# EAGLE schematic fmc-host (EAGLE 8.3.2)
DESIGNER: JON NEWMAN; DESIGN_NAME: ONIX FMC HOST; LICENSE: SEE LICENSE FILE; REVISION: F
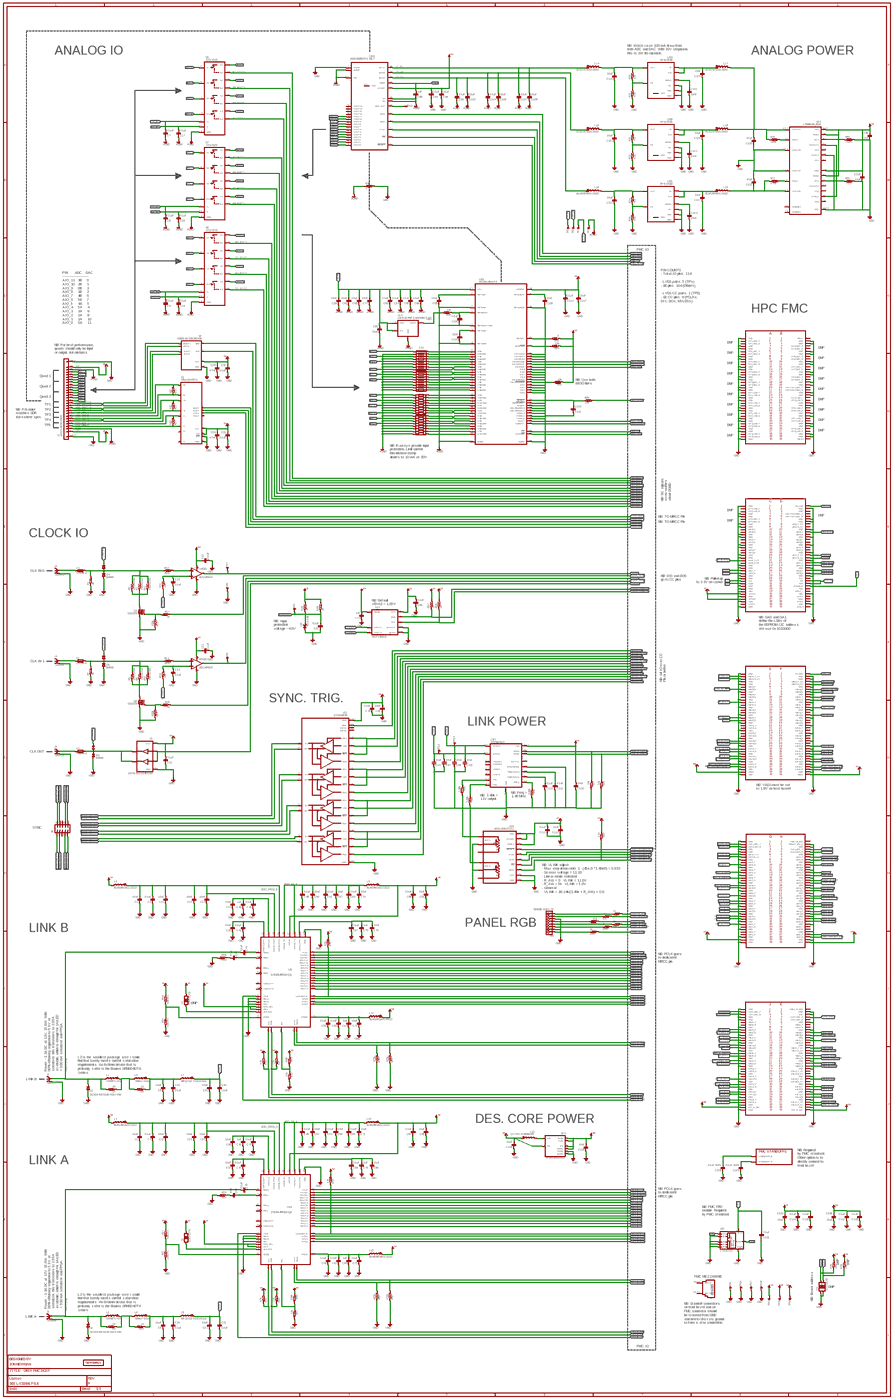
[diagram p0: schematic, sheet 1, overview]
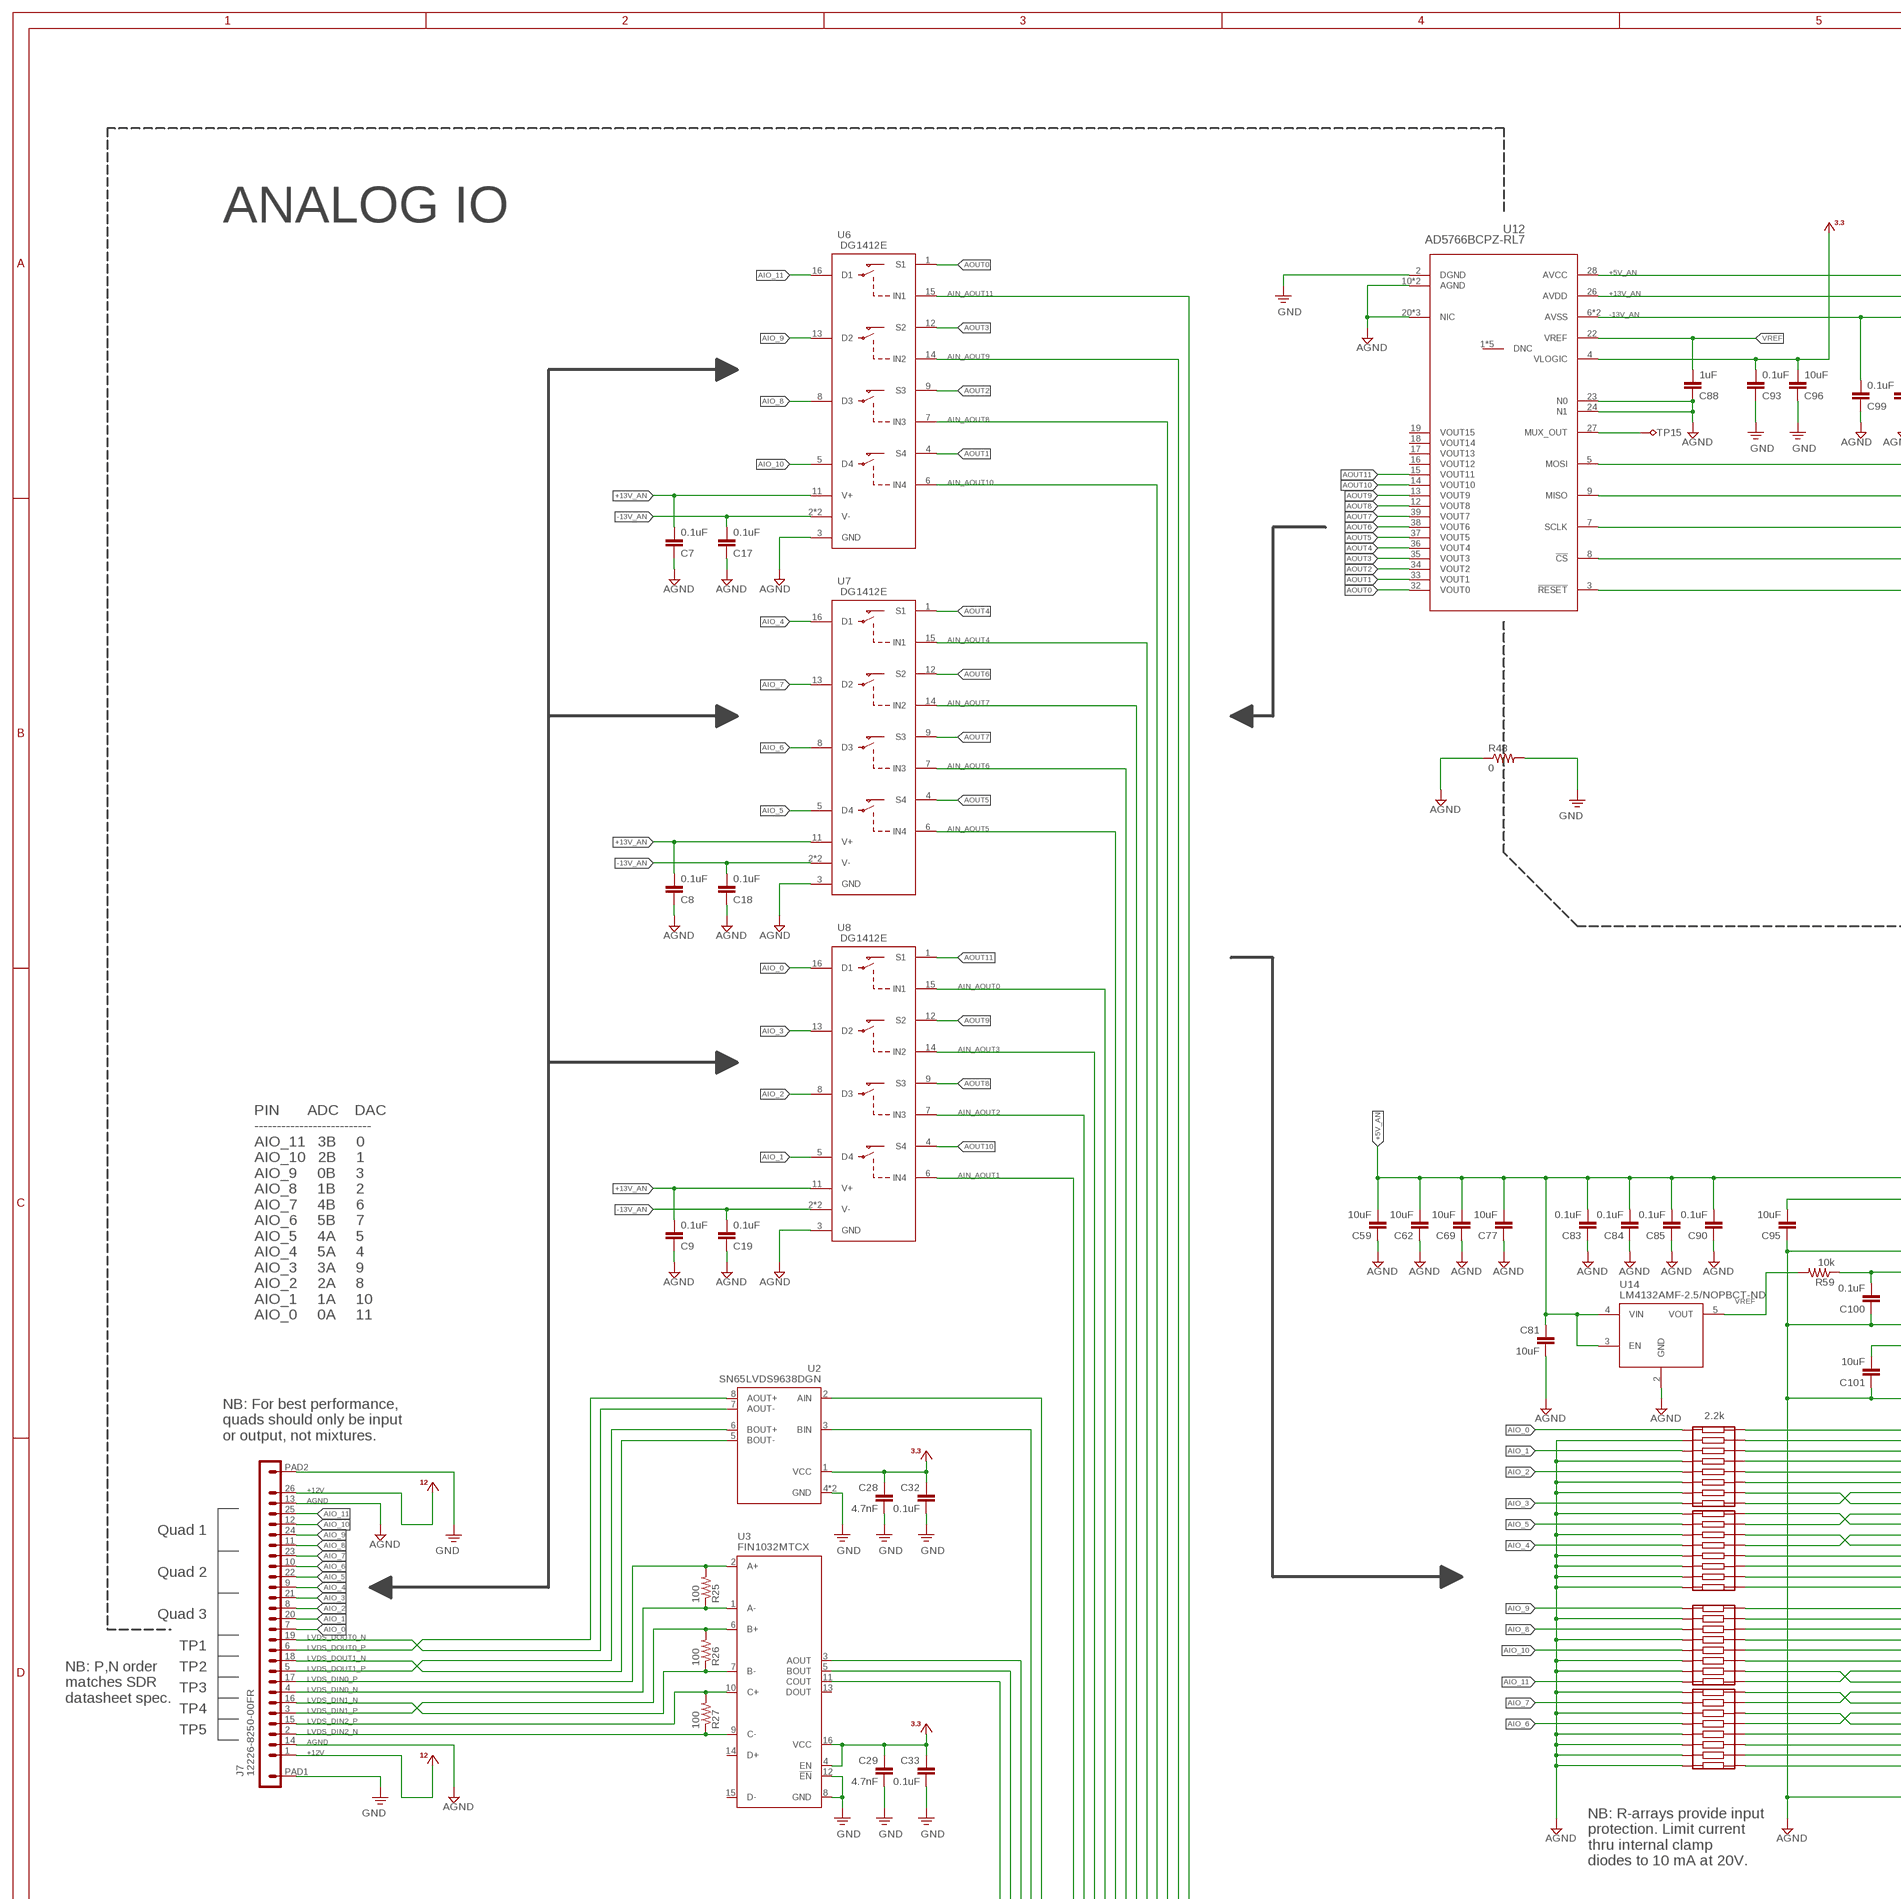
[diagram p1: schematic, sheet 1, part 1 of 8]
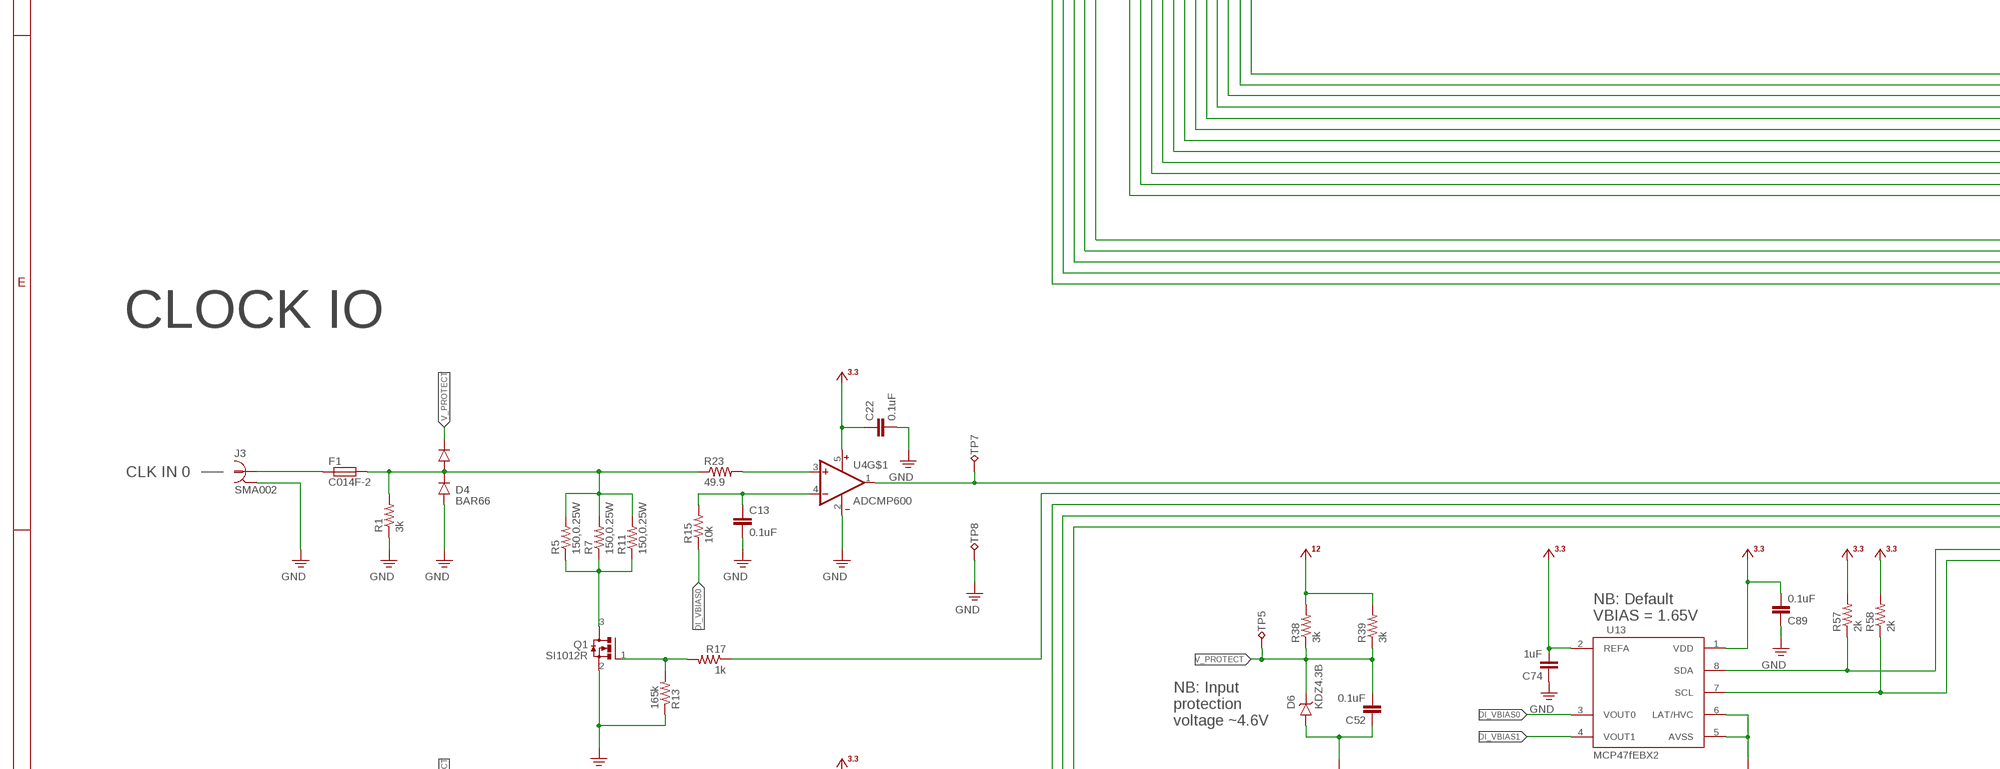
[diagram p2: schematic, sheet 1, part 2 of 8]
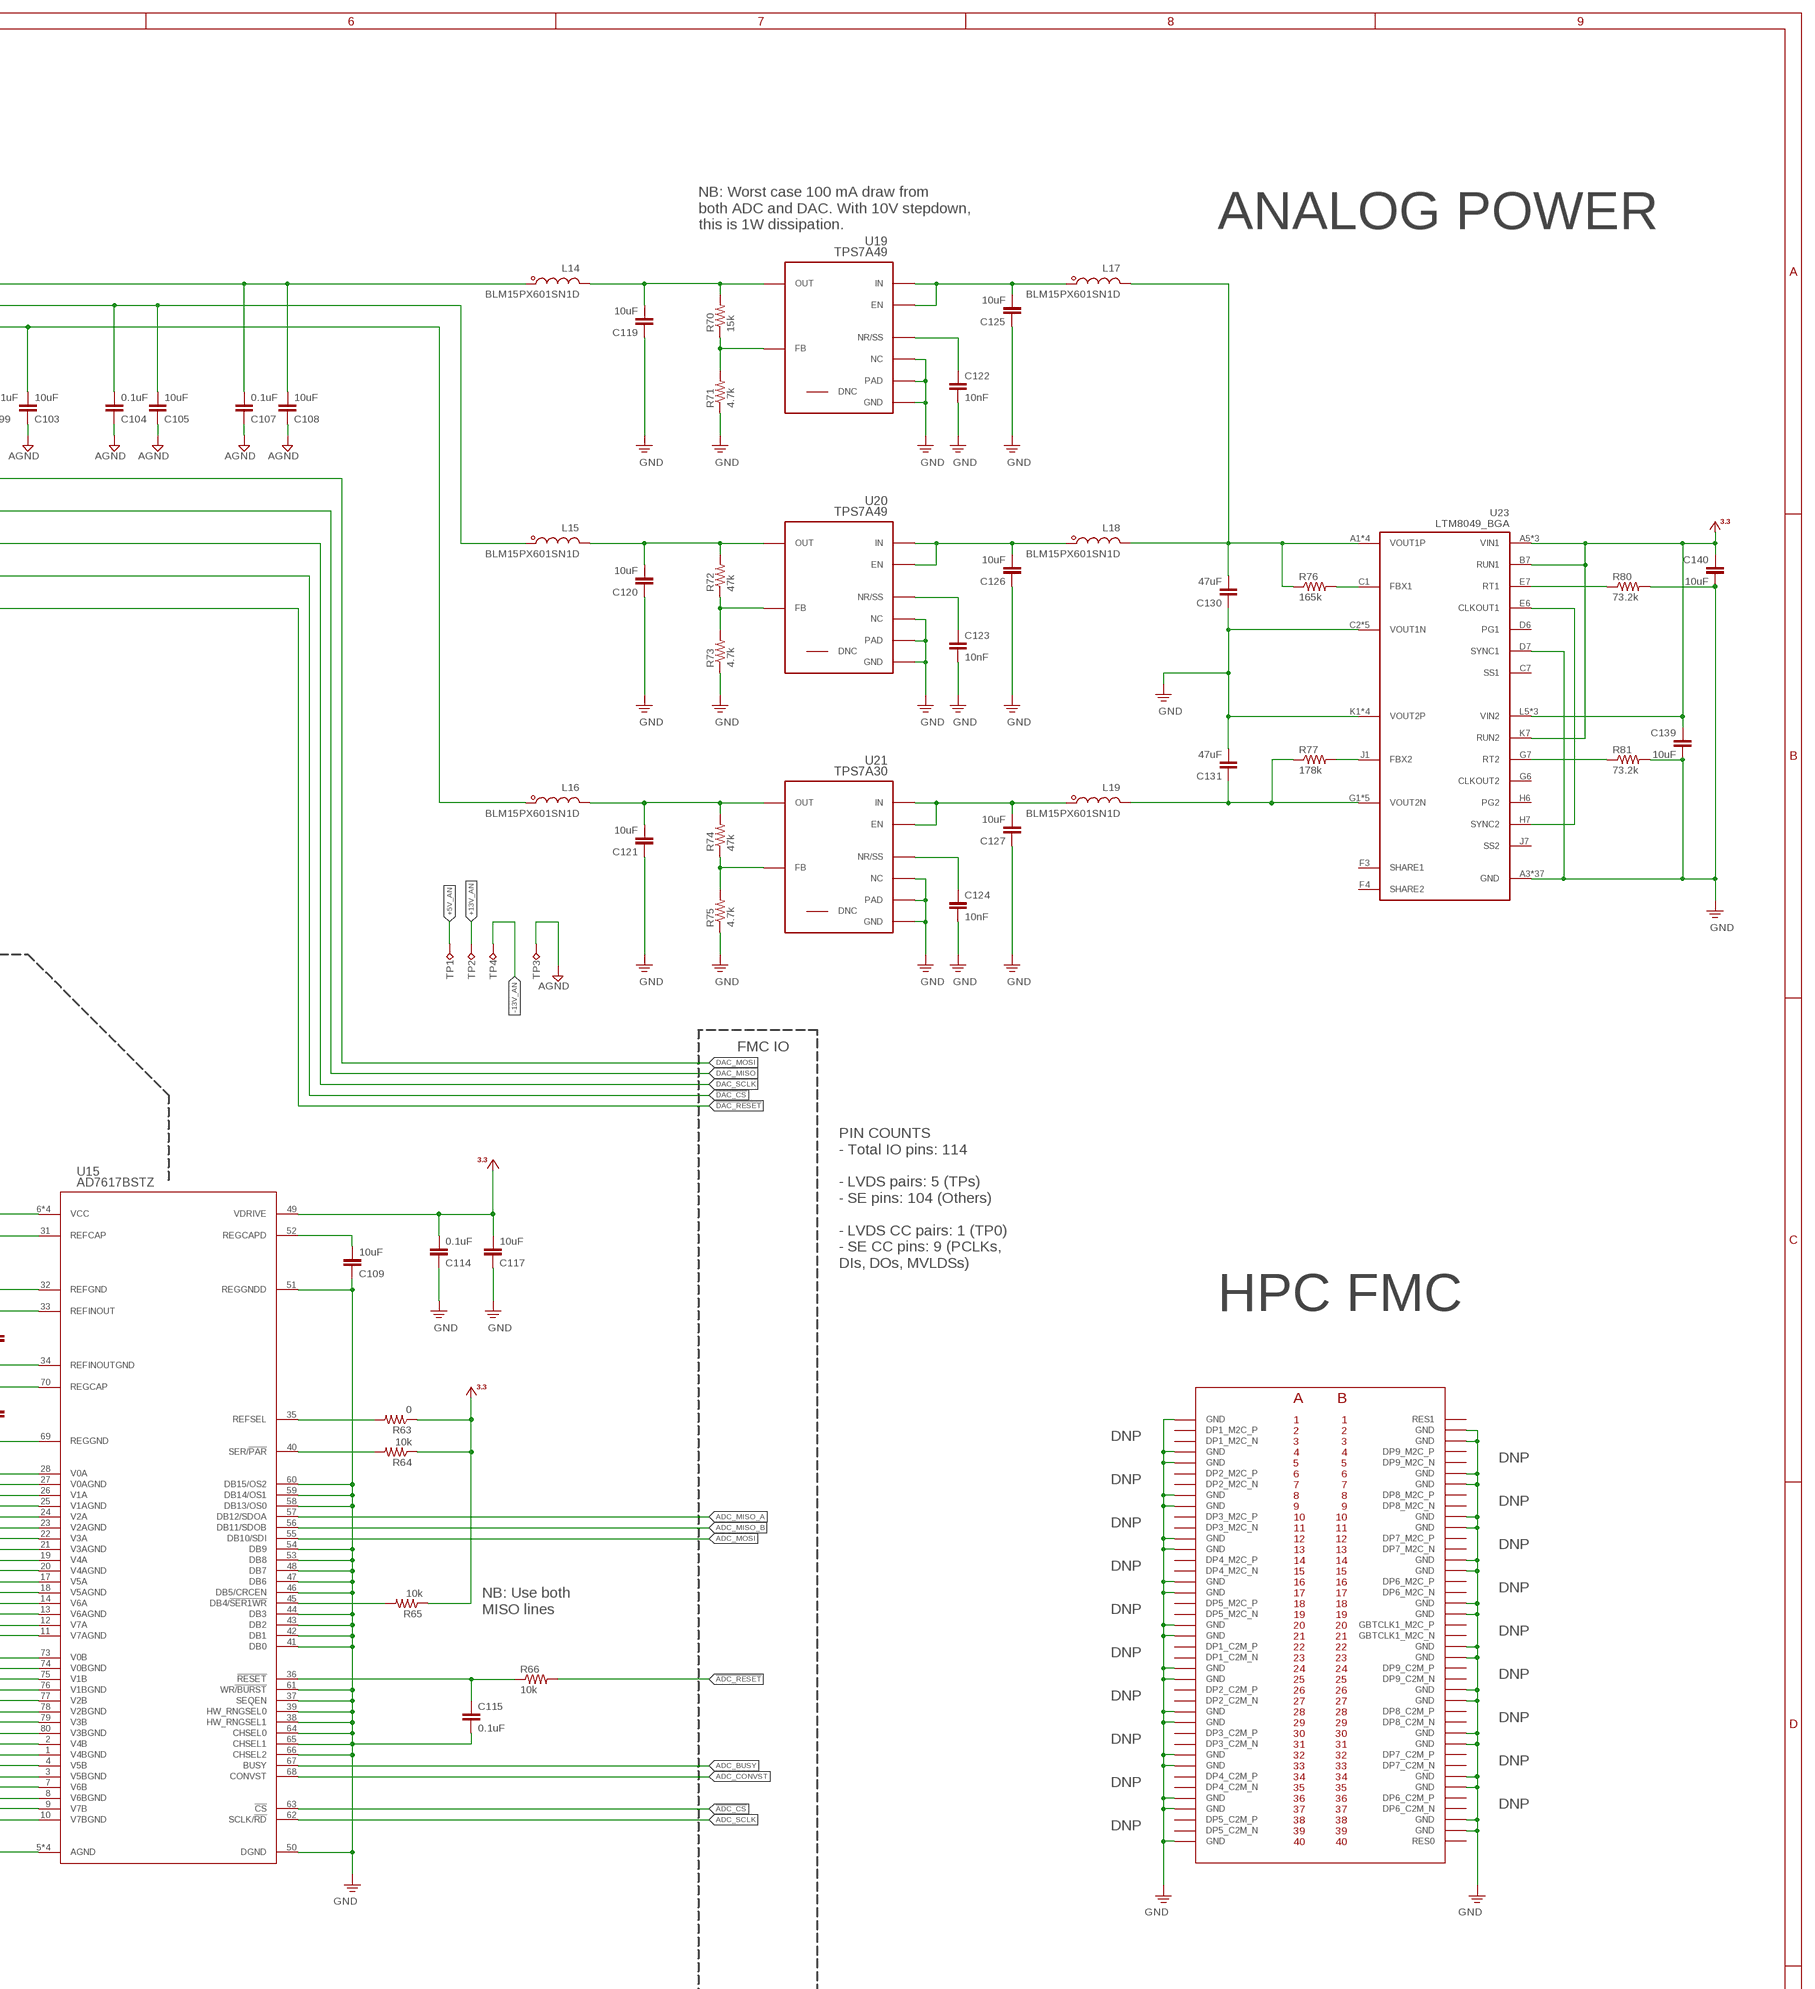
[diagram p3: schematic, sheet 1, part 3 of 8]
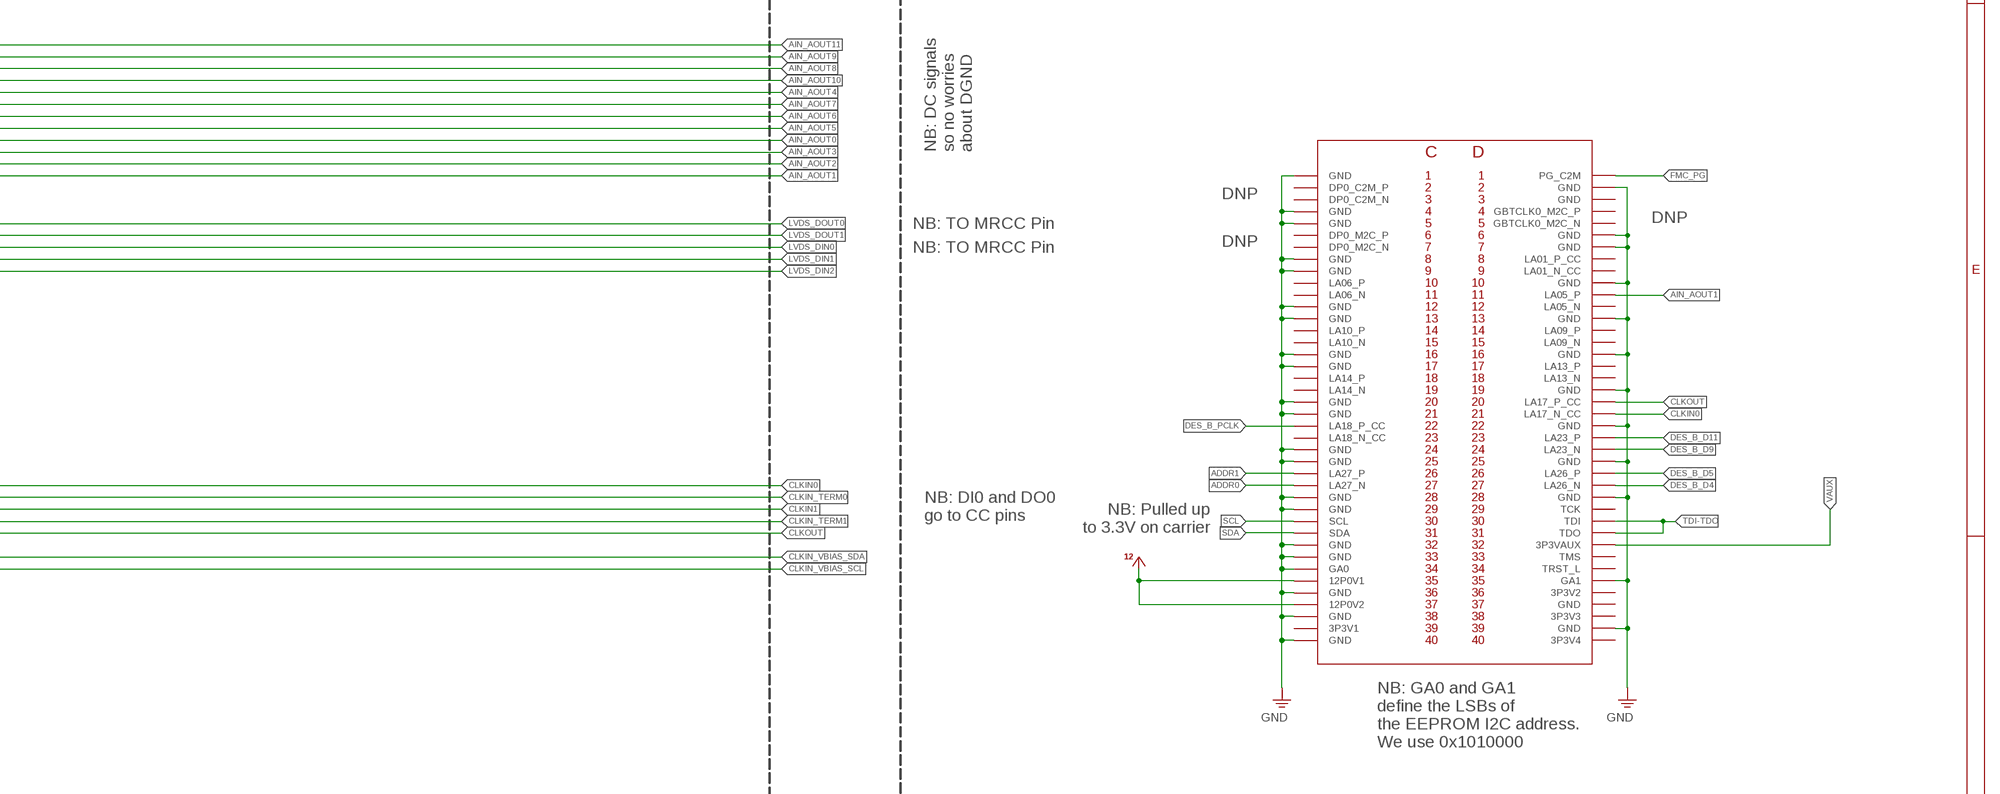
[diagram p4: schematic, sheet 1, part 4 of 8]
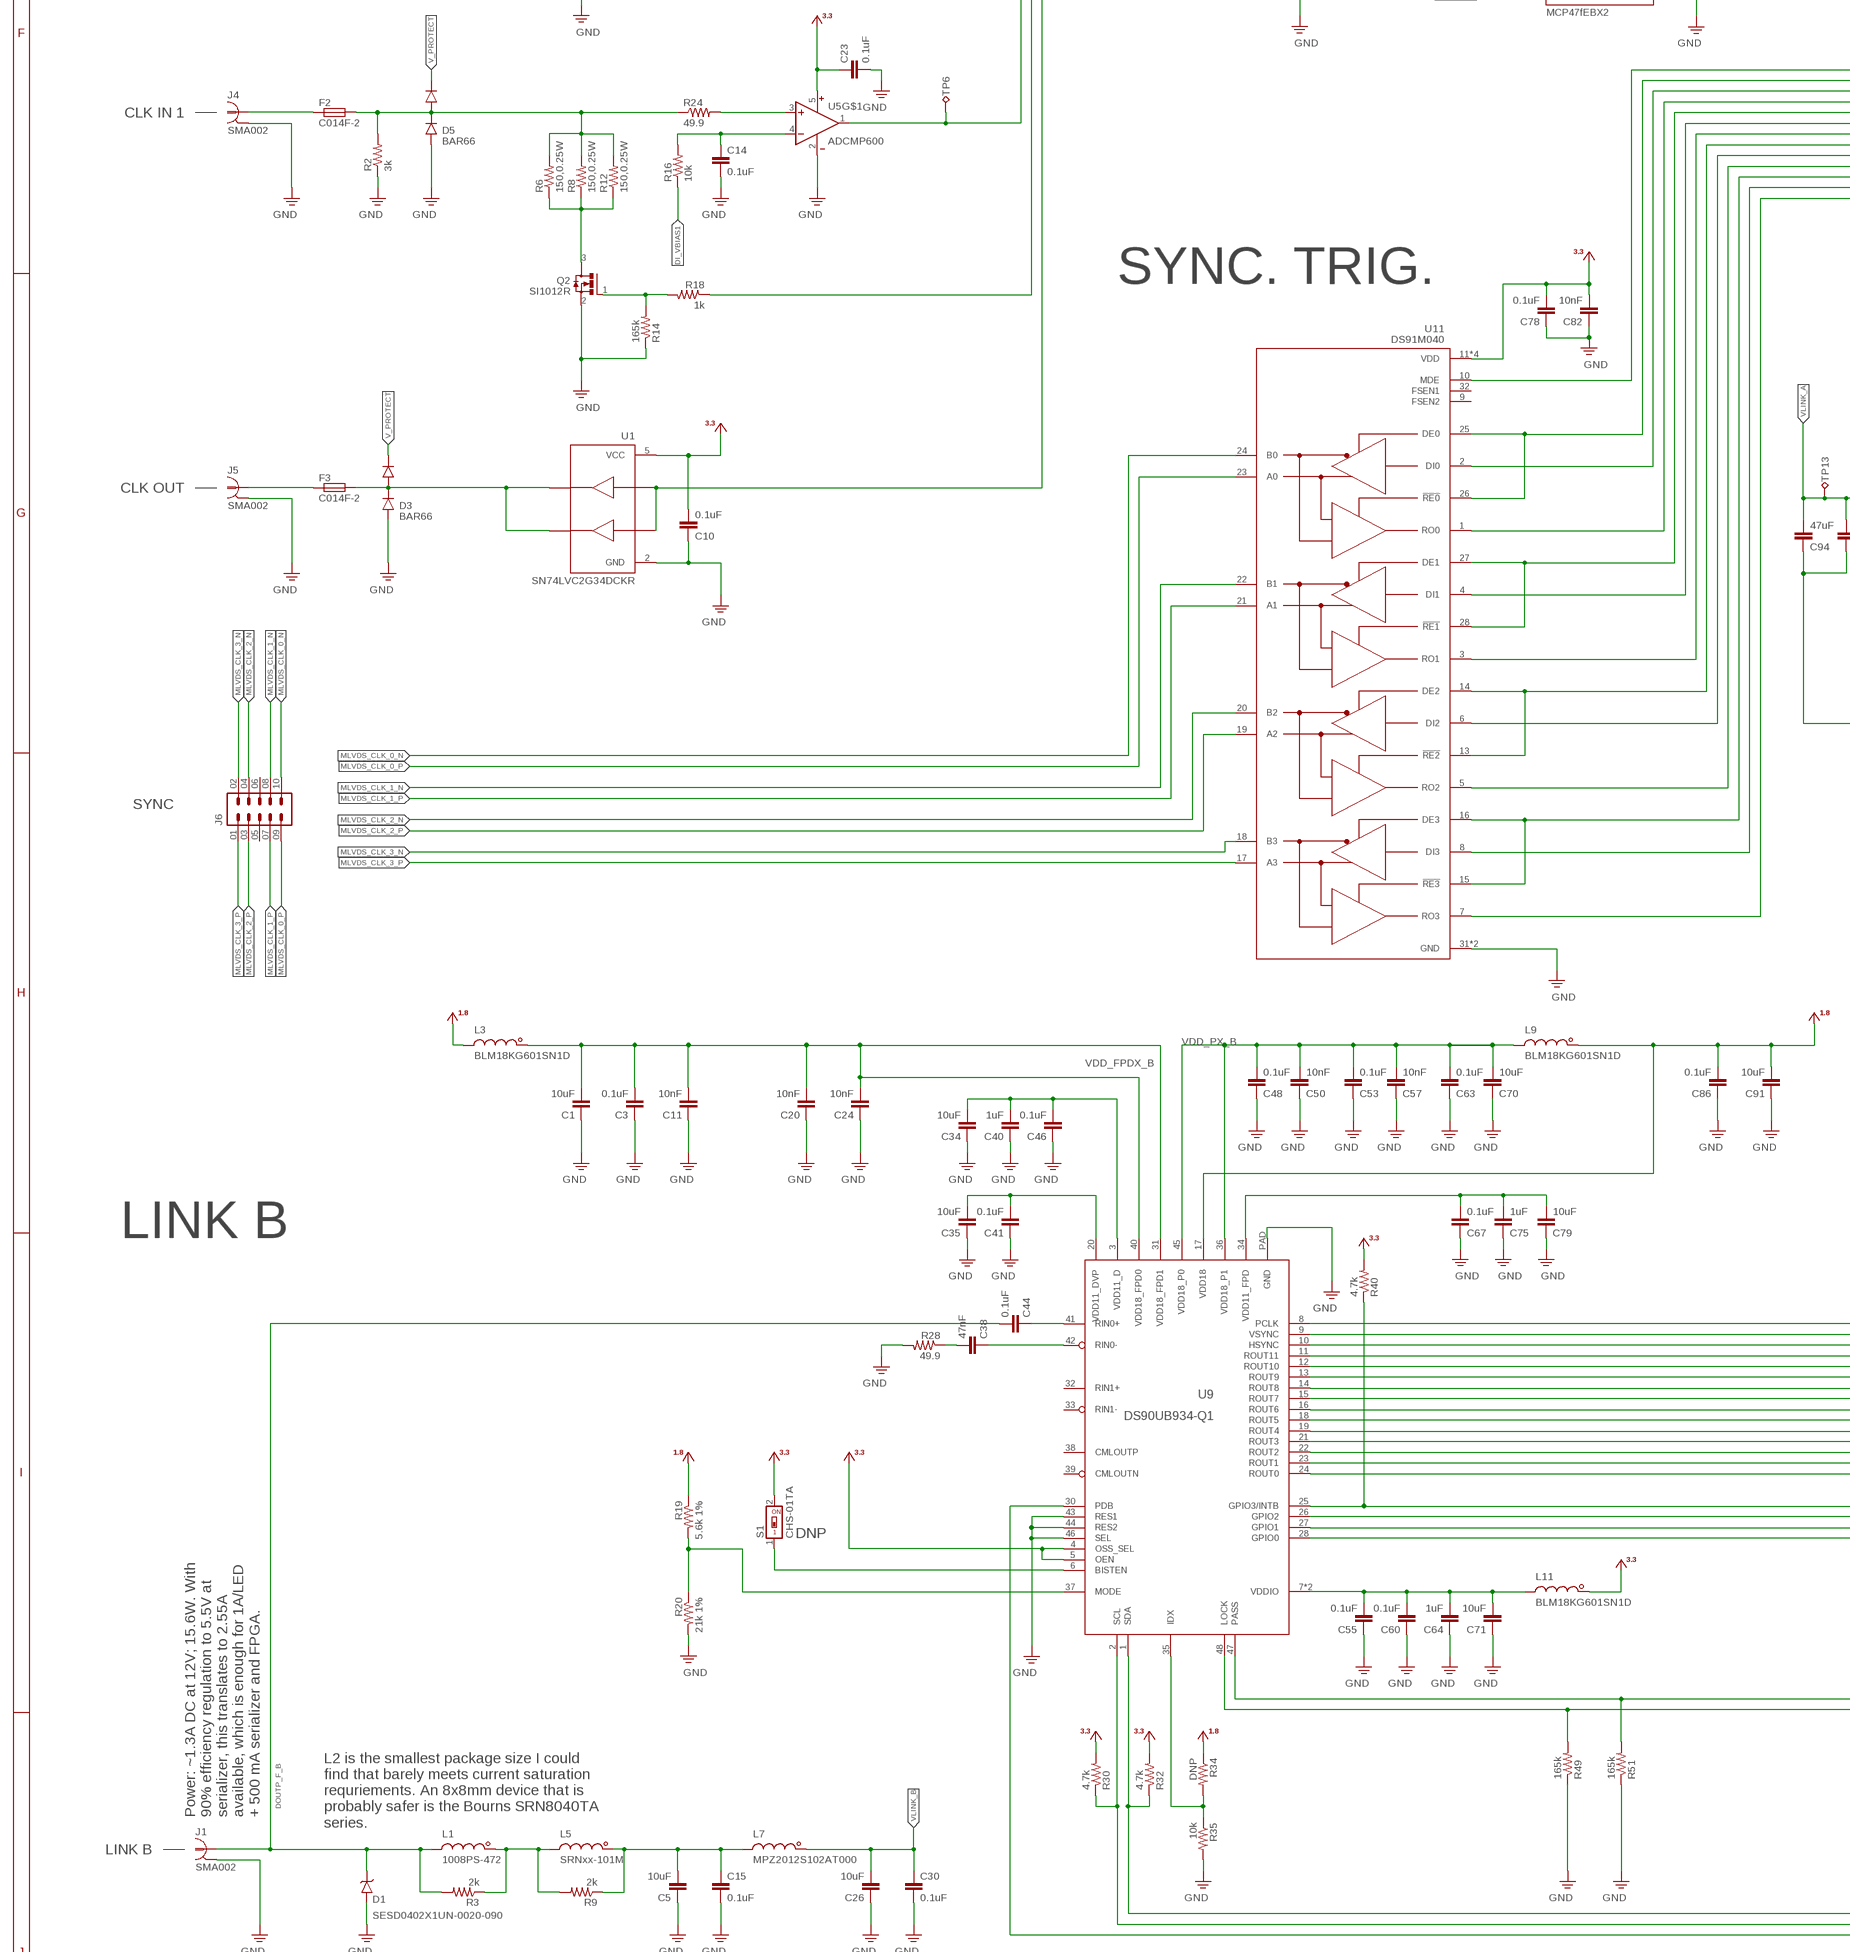
[diagram p5: schematic, sheet 1, part 5 of 8]
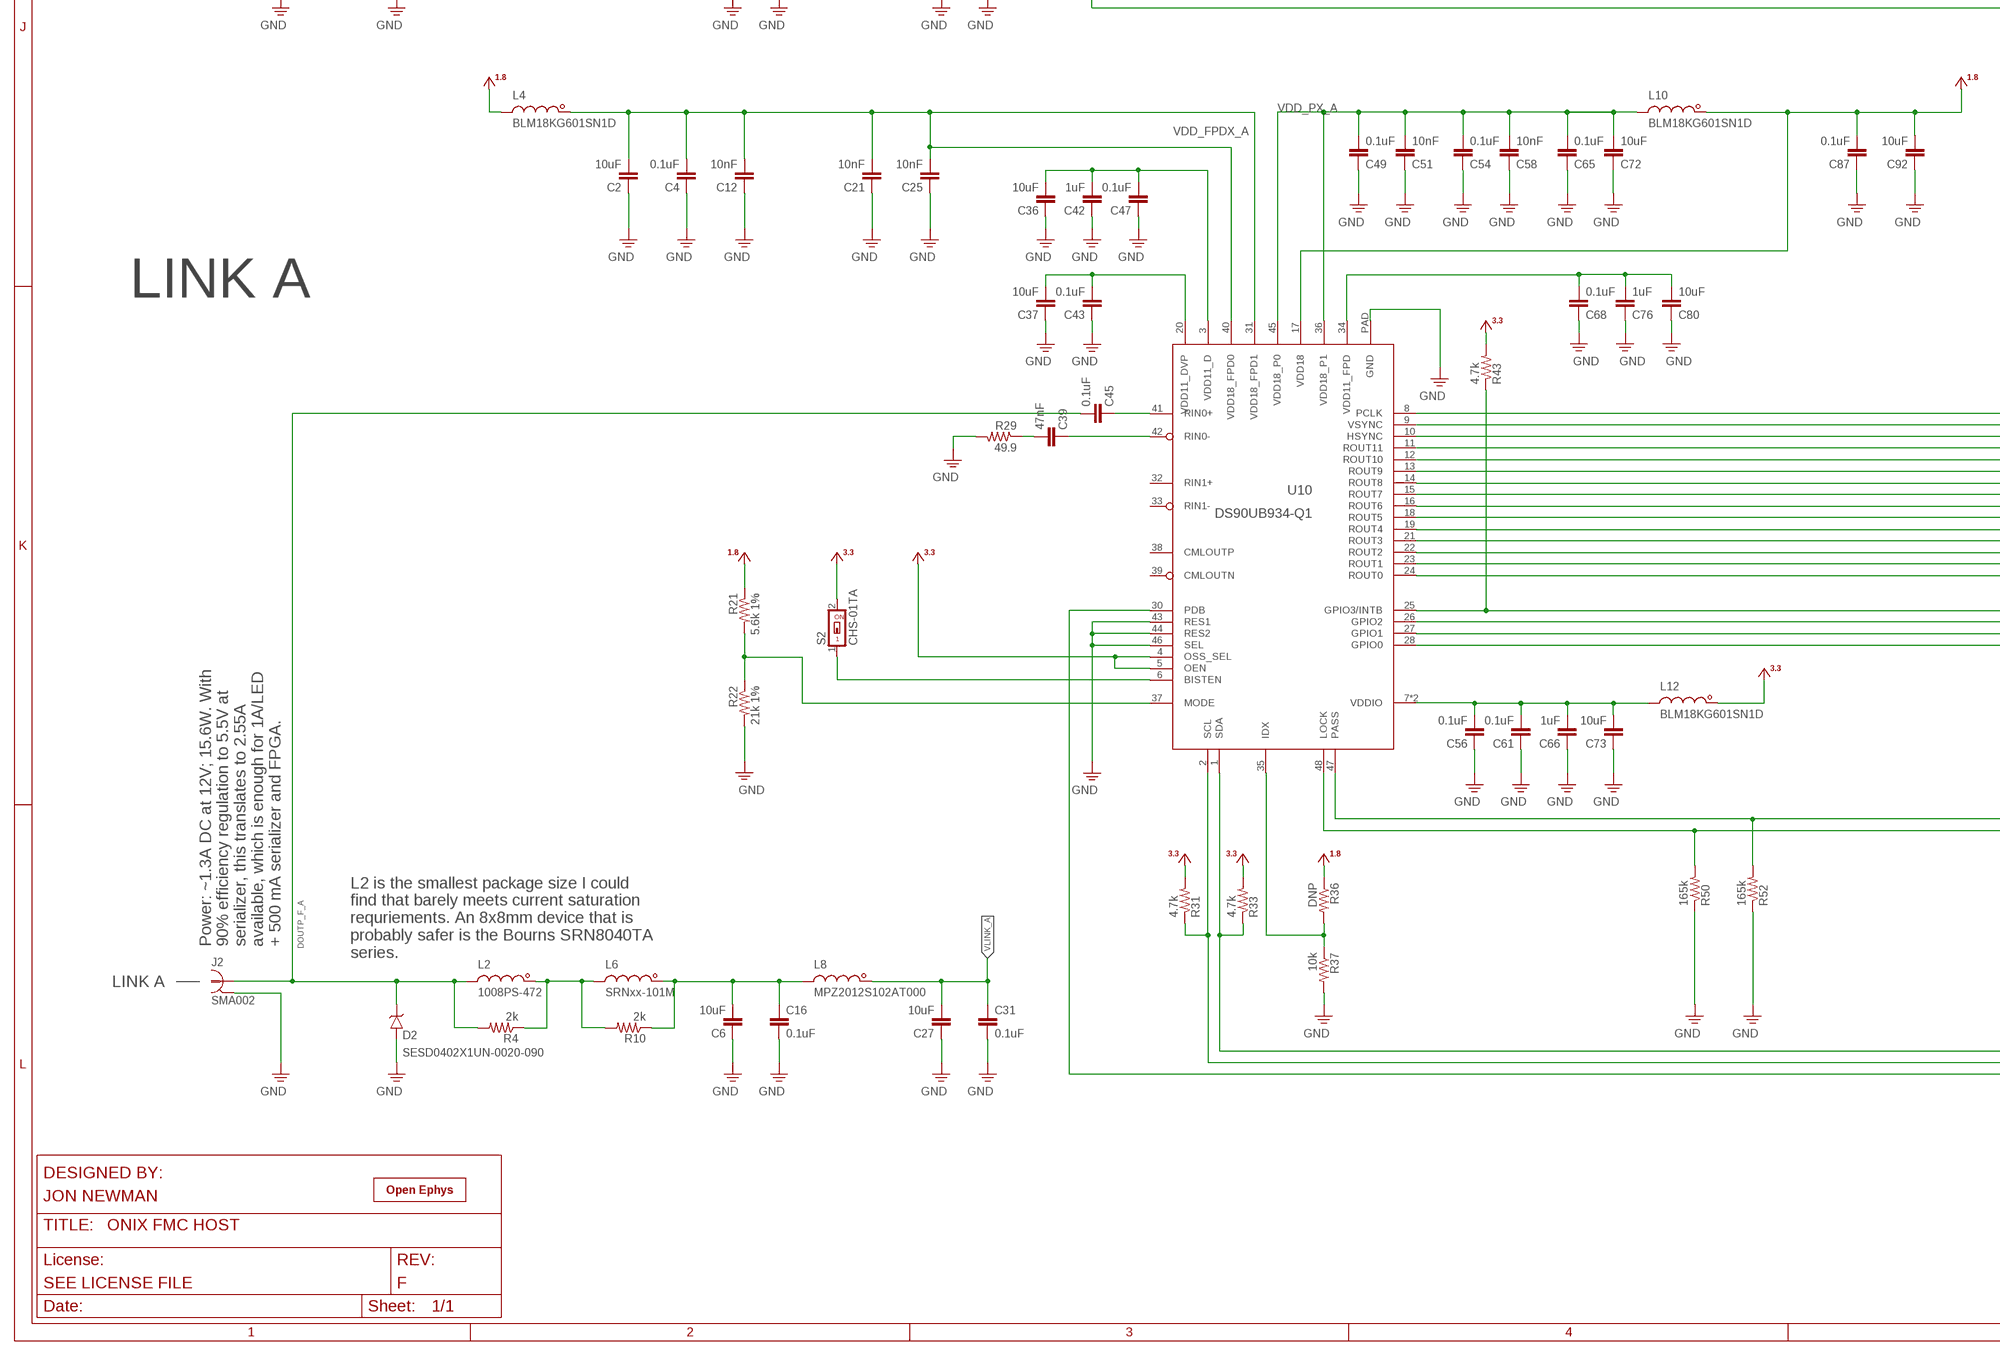
[diagram p6: schematic, sheet 1, part 6 of 8]
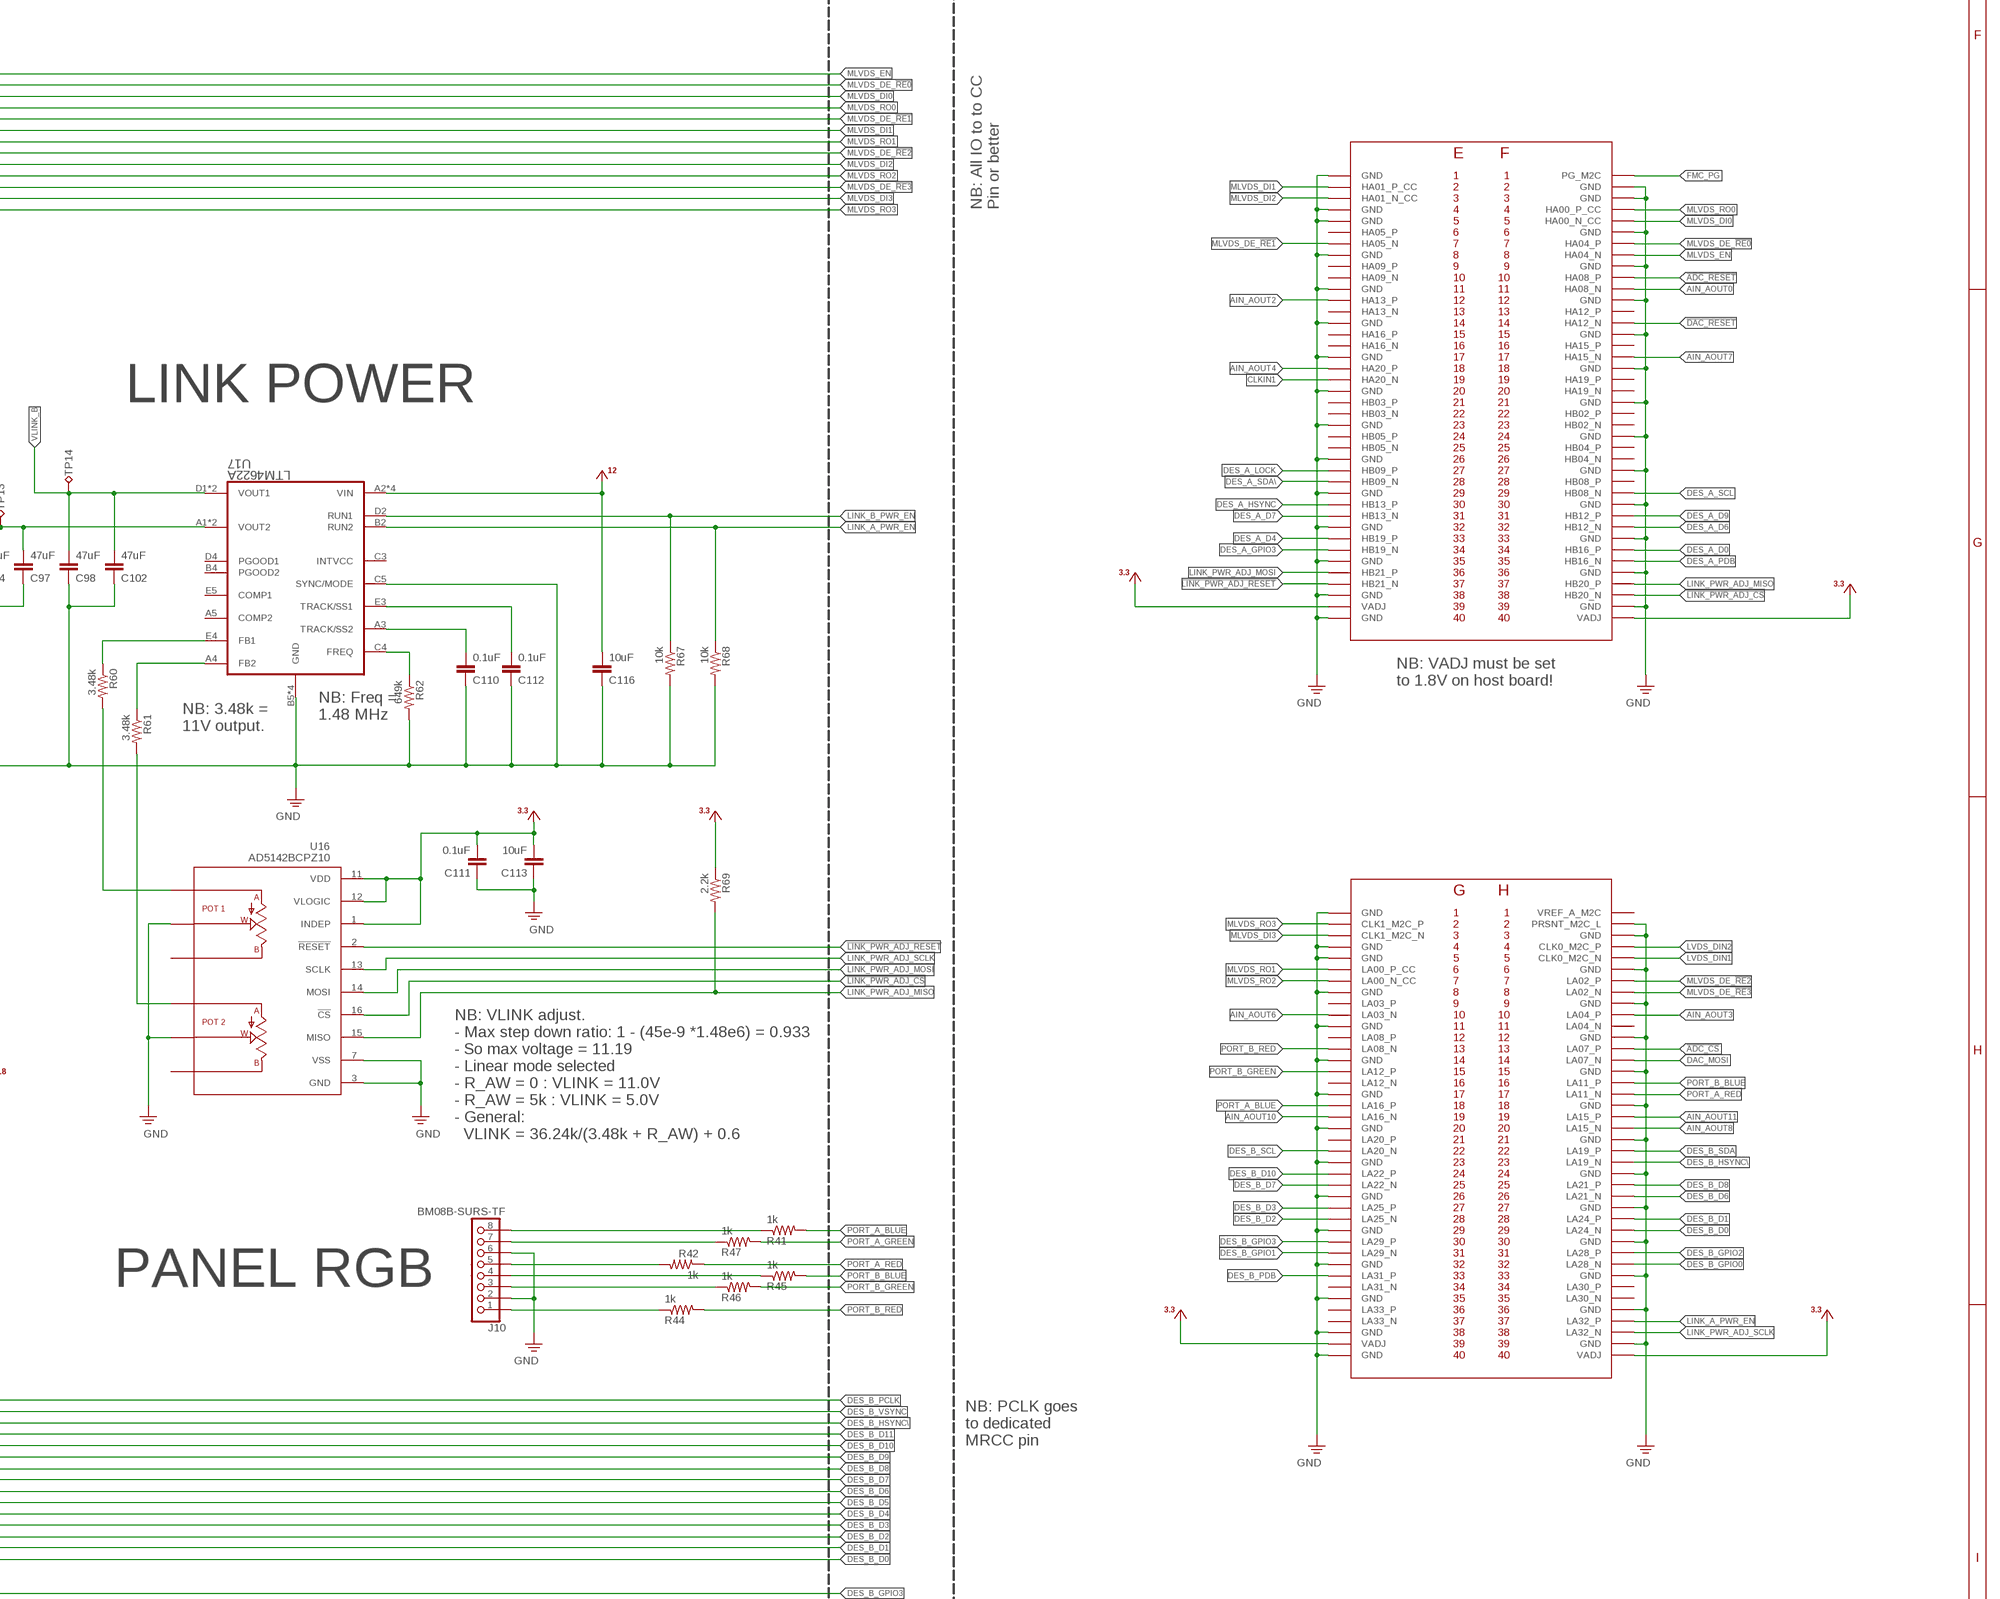
[diagram p7: schematic, sheet 1, part 7 of 8]
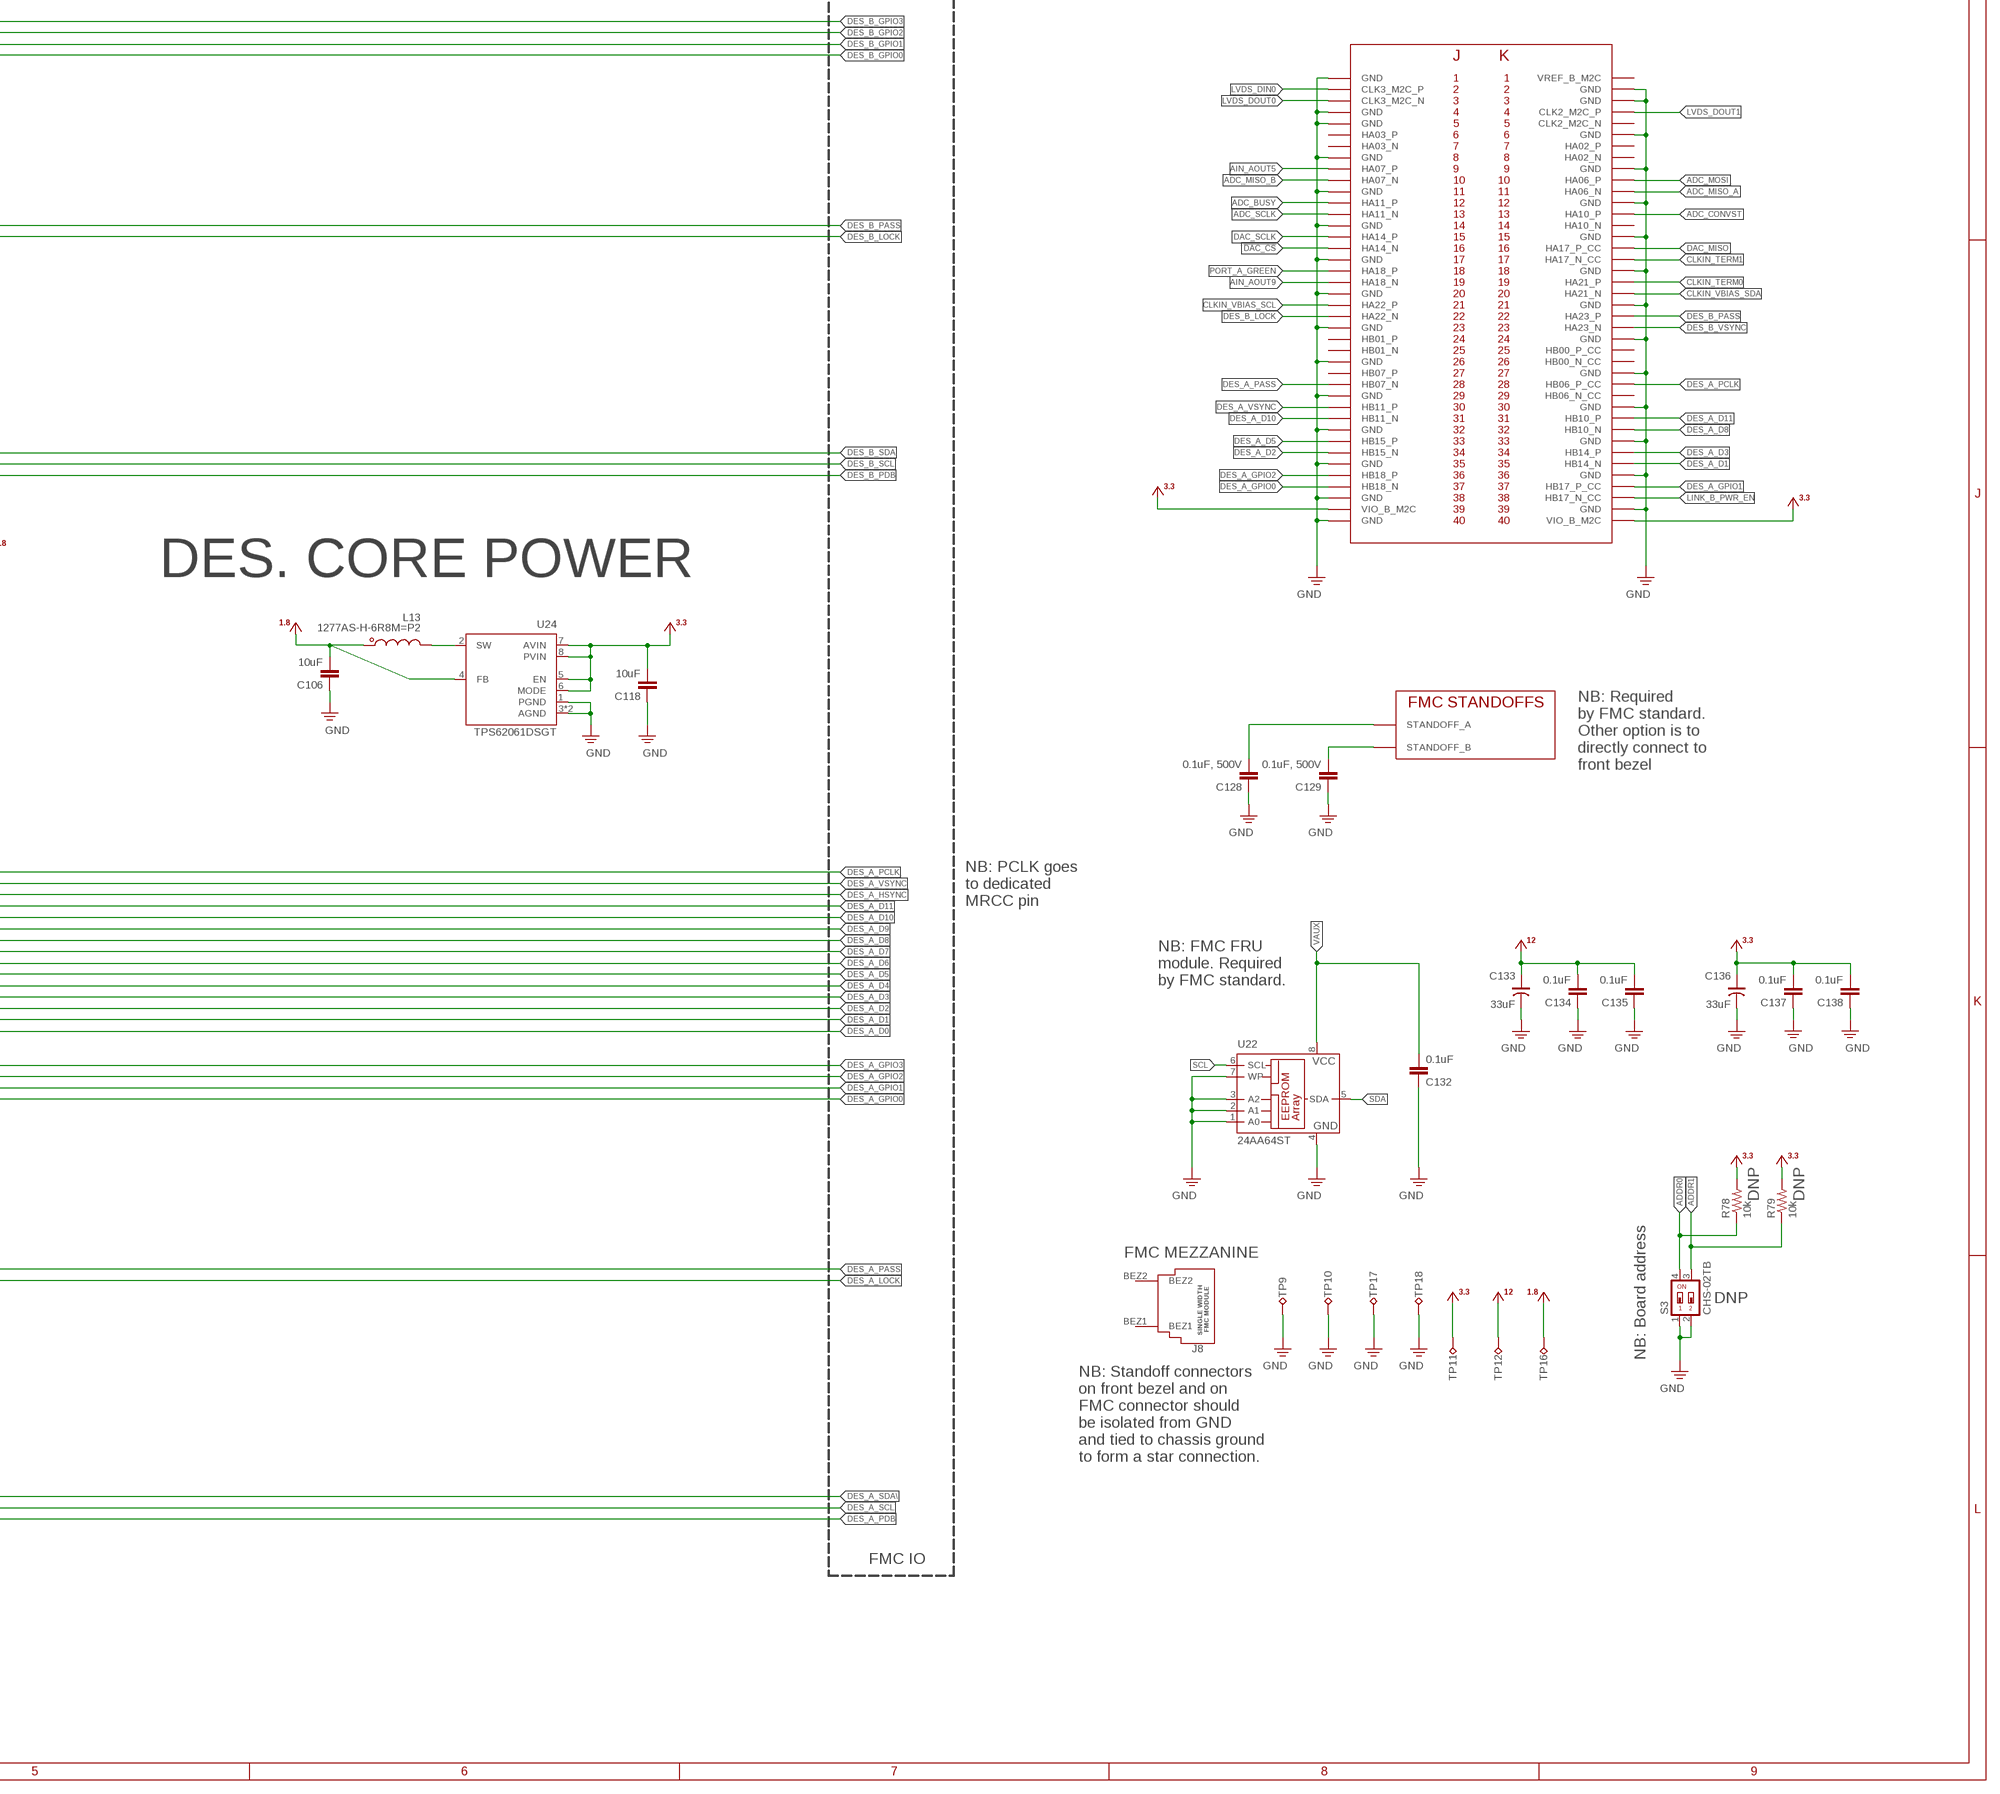
[diagram p8: schematic, sheet 1, part 8 of 8]

## Parts
C1  10uF  C_1206  [1206]
C2  10uF  C_1206  [1206]
C3  0.1uF  C_0402  [0402]
C4  0.1uF  C_0402  [0402]
C5  10uF  C_1206  [1206]
C6  10uF  C_1206  [1206]
C7  0.1uF  C_0402  [0402]
C8  0.1uF  C_0402  [0402]
C9  0.1uF  C_0402  [0402]
C10  0.1uF  C_0402  [0402]
C11  10nF  C_0402  [0402]
C12  10nF  C_0402  [0402]
C13  0.1uF  C_0402  [0402]
C14  0.1uF  C_0402  [0402]
C15  0.1uF  C_0402  [0402]
C16  0.1uF  C_0402  [0402]
C17  0.1uF  C_0402  [0402]
C18  0.1uF  C_0402  [0402]
C19  0.1uF  C_0402  [0402]
C20  10nF  C_0402  [0402]
C21  10nF  C_0402  [0402]
C22  0.1uF  C_0402  [0402]
C23  0.1uF  C_0402  [0402]
C24  10nF  C_0402  [0402]
C25  10nF  C_0402  [0402]
C26  10uF  C_1206  [1206]
C27  10uF  C_1206  [1206]
C28  4.7nF  C_0402  [0402]
C29  4.7nF  C_0402  [0402]
C30  0.1uF  C_0402  [0402]
C31  0.1uF  C_0402  [0402]
C32  0.1uF  C_0402  [0402]
C33  0.1uF  C_0402  [0402]
C34  10uF  C_1206  [1206]
C35  10uF  C_1206  [1206]
C36  10uF  C_1206  [1206]
C37  10uF  C_1206  [1206]
C38  47nF  C_0402  [0402]
C39  47nF  C_0402  [0402]
C40  1uF  C_0805  [0805]
C41  0.1uF  C_0402  [0402]
C42  1uF  C_0805  [0805]
C43  0.1uF  C_0402  [0402]
C44  0.1uF  C_0402  [0402]
C45  0.1uF  C_0402  [0402]
C46  0.1uF  C_0402  [0402]
C47  0.1uF  C_0402  [0402]
C48  0.1uF  C_0402  [0402]
C49  0.1uF  C_0402  [0402]
C50  10nF  C_0402  [0402]
C51  10nF  C_0402  [0402]
C52  0.1uF  C_0402  [0402]
C53  0.1uF  C_0402  [0402]
C54  0.1uF  C_0402  [0402]
C55  0.1uF  C_0402  [0402]
C56  0.1uF  C_0402  [0402]
C57  10nF  C_0402  [0402]
C58  10nF  C_0402  [0402]
C59  10uF  C_0805  [0805]
C60  0.1uF  C_0402  [0402]
C61  0.1uF  C_0402  [0402]
C62  10uF  C_0805  [0805]
C63  0.1uF  C_0402  [0402]
C64  1uF  C_0805  [0805]
C65  0.1uF  C_0402  [0402]
C66  1uF  C_0805  [0805]
C67  0.1uF  C_0402  [0402]
C68  0.1uF  C_0402  [0402]
C69  10uF  C_0805  [0805]
C70  10uF  C_1206  [1206]
C71  10uF  C_1206  [1206]
C72  10uF  C_1206  [1206]
C73  10uF  C_1206  [1206]
C74  1uF  C_0805  [0805]
C75  1uF  C_0805  [0805]
C76  1uF  C_0805  [0805]
C77  10uF  C_0805  [0805]
C78  0.1uF  C_0402  [0402]
C79  10uF  C_1206  [1206]
C80  10uF  C_1206  [1206]
C81  10uF  C_1206  [1206]
C82  10nF  C_0402  [0402]
C83  0.1uF  C_0402  [0402]
C84  0.1uF  C_0402  [0402]
C85  0.1uF  C_0402  [0402]
C86  0.1uF  C_0402  [0402]
C87  0.1uF  C_0402  [0402]
C88  1uF  C_0805  [0805]
C89  0.1uF  C_0402  [0402]
C90  0.1uF  C_0402  [0402]
C91  10uF  C_1206  [1206]
C92  10uF  C_1206  [1206]
C93  0.1uF  C_0402  [0402]
C94  47uF  C_1210  [1210]
C95  10uF  C_0805  [0805]
C96  10uF  C_0805  [0805]
C97  47uF  C_1210  [1210]
C98  47uF  C_1210  [1210]
C99  0.1uF  C_0402  [0402]
C100  0.1uF  C_0402  [0402]
C101  10uF  C_0805  [0805]
C102  47uF  C_1210  [1210]
C103  10uF  C_0805  [0805]
C104  0.1uF  C_0402  [0402]
C105  10uF  C_0805  [0805]
C106  10uF  C_1206  [1206]
C107  0.1uF  C_0402  [0402]
C108  10uF  C_0805  [0805]
C109  10uF  C_0805  [0805]
C110  0.1uF  C_0402  [0402]
C111  0.1uF  C_0402  [0402]
C112  0.1uF  C_0402  [0402]
C113  10uF  C_0805  [0805]
C114  0.1uF  C_0402  [0402]
C115  0.1uF  C_0402  [0402]
C116  10uF  C_0805  [0805]
C117  10uF  C_0805  [0805]
C118  10uF  C_1206  [1206]
C119  10uF  C_0805  [0805]
C120  10uF  C_0805  [0805]
C121  10uF  C_0805  [0805]
C122  10nF  C_0402  [0402]
C123  10nF  C_0402  [0402]
C124  10nF  C_0402  [0402]
C125  10uF  C_0805  [0805]
C126  10uF  C_0805  [0805]
C127  10uF  C_0805  [0805]
C128  0.1uF, 500V  C_1210  [1210]
C129  0.1uF, 500V  C_1210  [1210]
C130  47uF  C_1210  [1210]
C131  47uF  C_1210  [1210]
C132  0.1uF  C_0402  [0402]
C133  33uF  C-POL_1411-VISHAY-B  [1411-VISHAY-B]
C134  0.1uF  C_0402  [0402]
C135  0.1uF  C_0402  [0402]
C136  33uF  C-POL_1411-VISHAY-B  [1411-VISHAY-B]
C137  0.1uF  C_0402  [0402]
C138  0.1uF  C_0402  [0402]
C139  10uF  C_1206  [1206]
C140  10uF  C_1206  [1206]
D1  SESD0402X1UN-0020-090  Z-DIODE_0402P-DFN  [0402P-DFN]
D2  SESD0402X1UN-0020-090  Z-DIODE_0402P-DFN  [0402P-DFN]
D3  BAR66  DIODE2_SOT23  [SOT23]
D4  BAR66  DIODE2_SOT23  [SOT23]
D5  BAR66  DIODE2_SOT23  [SOT23]
D6  KDZ4.3B  Z-DIODE_SOD123  [SOD123]
F1  C014F-2  FUSE_1812  [1812]
F2  C014F-2  FUSE_1812  [1812]
F3  C014F-2  FUSE_1812  [1812]
J1  SMA002  COAX_MMCX-THRU  [MMCX-THRU]
J2  SMA002  COAX_MMCX-THRU  [MMCX-THRU]
J3  SMA002  COAX_MMCX-THRU  [MMCX-THRU]
J4  SMA002  COAX_MMCX-THRU  [MMCX-THRU]
J5  SMA002  COAX_MMCX-THRU  [MMCX-THRU]
J6  FTSH-105-01-F-D-RA-K  PINHD-2X5_FTSH  [FTSH-105-01-F-D-RA-K]
J7  12226-8250-00FR  PINHD-1X26_122  [12226-82X0-00XX]
J8  FMC_SINGLE_WIDTH_MODULE  [FMC_SINGLE_WIDTH_MODULE]
J9  ASP-134488-01  FMC_HPC_400_PIN_MALE  [FMC_HPC_MALE]
J10  BM08B-SURS-TF  PINHD-1X8_SURS-TF  [BM08B-SURS-TF]
L1  1008PS-472  L_1008PS  [1008PS]
L2  1008PS-472  L_1008PS  [1008PS]
L3  BLM18KG601SN1D  L_0603  [0603]
L4  BLM18KG601SN1D  L_0603  [0603]
L5  SRNxx-101M  L_SRN6045TA  [SRN6045TA]
L6  SRNxx-101M  L_SRN6045TA  [SRN6045TA]
L7  MPZ2012S102AT000  L_0805  [0805]
L8  MPZ2012S102AT000  L_0805  [0805]
L9  BLM18KG601SN1D  L_0603  [0603]
L10  BLM18KG601SN1D  L_0603  [0603]
L11  BLM18KG601SN1D  L_0603  [0603]
L12  BLM18KG601SN1D  L_0603  [0603]
L13  1277AS-H-6R8M=P2  L_1210  [1210]
L14  BLM15PX601SN1D  L_0402  [0402]
L15  BLM15PX601SN1D  L_0402  [0402]
L16  BLM15PX601SN1D  L_0402  [0402]
L17  BLM15PX601SN1D  L_0402  [0402]
L18  BLM15PX601SN1D  L_0402  [0402]
L19  BLM15PX601SN1D  L_0402  [0402]
Q1  SI1012R  N-MOSFET_SC75-GSD  [SC75]
Q2  SI1012R  N-MOSFET_SC75-GSD  [SC75]
R1  3k  R_0402  [0402]
R2  3k  R_0402  [0402]
R3  2k  R_0402  [0402]
R4  2k  R_0402  [0402]
R5  150,0.25W  R_0603  [0603]
R6  150,0.25W  R_0603  [0603]
R7  150,0.25W  R_0603  [0603]
R8  150,0.25W  R_0603  [0603]
R9  2k  R_0402  [0402]
R10  2k  R_0402  [0402]
R11  150,0.25W  R_0603  [0603]
R12  150,0.25W  R_0603  [0603]
R13  165k  R_0402  [0402]
R14  165k  R_0402  [0402]
R15  10k  R_0402  [0402]
R16  10k  R_0402  [0402]
R17  1k  R_0402  [0402]
R18  1k  R_0402  [0402]
R19  5.6k 1%  R_0402  [0402]
R20  21k 1%  R_0402  [0402]
R21  5.6k 1%  R_0402  [0402]
R22  21k 1%  R_0402  [0402]
R23  49.9  R_0402  [0402]
R24  49.9  R_0402  [0402]
R25  100  R_0402  [0402]
R26  100  R_0402  [0402]
R27  100  R_0402  [0402]
R28  49.9  R_0402  [0402]
R29  49.9  R_0402  [0402]
R30  4.7k  R_0402  [0402]
R31  4.7k  R_0402  [0402]
R32  4.7k  R_0402  [0402]
R33  4.7k  R_0402  [0402]
R34  DNP  R_0402  [0402]
R35  10k  R_0402  [0402]
R36  DNP  R_0402  [0402]
R37  10k  R_0402  [0402]
R38  3k  R_0402  [0402]
R39  3k  R_0402  [0402]
R40  4.7k  R_0402  [0402]
R41  1k  R_0402  [0402]
R42  1k  R_0402  [0402]
R43  4.7k  R_0402  [0402]
R44  1k  R_0402  [0402]
R45  1k  R_0402  [0402]
R46  1k  R_0402  [0402]
R47  1k  R_0402  [0402]
R48  0  R_0402  [0402]
R49  165k  R_0402  [0402]
R50  165k  R_0402  [0402]
R51  165k  R_0402  [0402]
R52  165k  R_0402  [0402]
R53  2.2k  RN2X8_1506  [RN2X8-1506]
R54  2.2k  RN2X8_1506  [RN2X8-1506]
R55  2.2k  RN2X8_1506  [RN2X8-1506]
R56  2.2k  RN2X8_1506  [RN2X8-1506]
R57  2k  R_0402  [0402]
R58  2k  R_0402  [0402]
R59  10k  R_0402  [0402]
R60  3.48k  R_0402  [0402]
R61  3.48k  R_0402  [0402]
R62  649k  R_0402  [0402]
R63  0  R_0402  [0402]
R64  10k  R_0402  [0402]
R65  10k  R_0402  [0402]
R66  10k  R_0402  [0402]
R67  10k  R_0402  [0402]
R68  10k  R_0402  [0402]
R69  2.2k  R_0402  [0402]
R70  15k  R_0402  [0402]
R71  4.7k  R_0402  [0402]
R72  47k  R_0402  [0402]
R73  4.7k  R_0402  [0402]
R74  47k  R_0402  [0402]
R75  4.7k  R_0402  [0402]
R76  165k  R_0402  [0402]
R77  178k  R_0402  [0402]
R78  10k  R_0402  [0402]
R79  10k  R_0402  [0402]
R80  73.2k  R_0402  [0402]
R81  73.2k  R_0402  [0402]
S1  CHS-01TA  DIPSW-001_GULL  [DIP01-SMD-GULL]
S2  CHS-01TA  DIPSW-001_GULL  [DIP01-SMD-GULL]
S3  CHS-02TB  DIPSW-002_CHS-02TB  [CHS-02TB]
TP1  TPB1,27  [B1,27]
TP2  TPB1,27  [B1,27]
TP3  TPB2,54  [B2,54]
TP4  TPB1,27  [B1,27]
TP5  TPB1,27  [B1,27]
TP6  TPB1,27  [B1,27]
TP7  TPB1,27  [B1,27]
TP8  TPB2,54  [B2,54]
TP9  TPB2,54  [B2,54]
TP10  TPB2,54  [B2,54]
TP11  TPB1,27  [B1,27]
TP12  TPB1,27  [B1,27]
TP13  TPB1,27  [B1,27]
TP14  TPB1,27  [B1,27]
TP15  TPB1,27  [B1,27]
TP16  TPB1,27  [B1,27]
TP17  TPB2,54  [B2,54]
TP18  TPB2,54  [B2,54]
U1  SN74LVC2G34DCKR  BUFFER-DUAL_SC70  [SC70]
U2  SN65LVDS9638DGN  LVDS_DRIVER_DUAL_MSOP  [MSOP-8-PAD-3X3]
U3  FIN1032MTCX  LVDS_RECEIVER_QUAD_TSSOP  [TSSOP-16]
U4  ADCMP600  COMPARITOR_ADCMP600  [SOT-23-5]
U5  ADCMP600  COMPARITOR_ADCMP600  [SOT-23-5]
U6  DG1412E  DG141XE_QUAD_SPST_QFN  [QFN16-4X4MM]
U7  DG1412E  DG141XE_QUAD_SPST_QFN  [QFN16-4X4MM]
U8  DG1412E  DG141XE_QUAD_SPST_QFN  [QFN16-4X4MM]
U9  DS90UB934-Q1  [WQFN48-7X7-PAD]
U10  DS90UB934-Q1  [WQFN48-7X7-PAD]
U11  DS91M040  DS91M040_WQFN32  [WQFN32-5X5]
U12  AD5766BCPZ-RL7  AD5767BCBZ-RL7_QFN  [CP_40_7]
U13  MCP47FEB02A0-E/ST  MCP47FEBX2  [TSSOP-8]
U14  LM4132AMF-2.5/NOPBCT-ND  VREF_EN_LM4132  [SOT-23-5]
U15  AD7617BSTZ  [ST_80_2]
U16  AD5142BCPZ10  AD51X2_TSSOP  [TSSOP-16_4.4X5.0]
U17  LTM4622A  LTM4622_BGA  [BGA_5X5_625X625]
U19  TPS7A49  TPS7AXX_PVSON  [PVSON-N8+4-3X3]
U20  TPS7A49  TPS7AXX_PVSON  [PVSON-N8+4-3X3]
U21  TPS7A30  TPS7AXX_PVSON  [PVSON-N8+4-3X3]
U22  24AA64ST  [TSSOP8]
U23  LTM8049_BGA  [LTM8049]
U24  TPS62061DSGT  TPS6206X  [WSON8-2X2]
X2  OE-LOGO_7X5  [OE-LOGO-7X5]

## Nets
!ADC_CS [50 Ohm Single Mid]: J9.H13(LA07_P) U15.63(!CS)
!ADC_RESET: J9.F10(HA08_P) R66.2
!DAC_CS [50 Ohm Single Mid]: J9.J16(HA14_N) U12.8(!CS)
!DAC_RESET: J9.F14(HA12_N) U12.3(!RESET)
!LINK_PWR_ADJ_CS: J9.F38(HB20_N) U16.16(!CS)
!LINK_PWR_ADJ_RESET: J9.E37(HB21_N) U16.2(!RESET)
$N1 [50 Ohm Single Top]: D5.3(COMM) F2.2 R2.2 R6.2 R8.2 R12.2 R24.1
$N2 [50 Ohm Single Top]: D3.3(COMM) F3.2 U1.4(OUT2) U1.6(OUT1)
$N3 [50 Ohm Single Top]: D4.3(COMM) F1.2 R1.2 R5.2 R7.2 R11.2 R23.1
+1V8: C86.2 C87.2 C91.2 C92.2 C106.2 L3.2 L4.2 L9.1 L10.1 L13.1 R19.1 R21.1 R34.1 R36.1 TP16.TP U9.17(VDD18) U10.17(VDD18) U24.4(FB)
+3V3: C10.2 C22.1 C23.1 C28.1 C29.1 C32.1 C33.1 C74.2 C78.2 C82.2 C89.2 C93.2 C96.2 C111.2 C113.2 C114.2 C117.2 C118.2 C136.A(+) C137.2 C138.2 C139.1 C140.1 J9.E39(VADJ) J9.F40(VADJ) J9.G39(VADJ) J9.H40(VADJ) J9.J39(VIO_B_M2C) J9.K40(VIO_B_M2C) L11.1 L12.1 R30.2 R31.2 R32.2 R33.2 R40.2 R43.2 R57.2 R58.2 R63.1 R64.1 R65.1 R69.1 R78.2 R79.2 S1.2 S2.2 TP11.TP U1.5(VCC) U2.1(VCC) U3.4(EN) U3.16(VCC) U4.5(V+) U5.5(V+) U9.4(OSS_SEL) U9.5(OEN) U10.4(OSS_SEL) U10.5(OEN) U11.11(VDD) U11.12(VDD) U11.29(VDD) U11.30(VDD) U12.4(VLOGIC) U13.1(VDD) U13.2(REFA) U15.49(VDRIVE) U16.1(INDEP) U16.11(VDD) U16.12(VLOGIC) U23.A5(VIN1) U23.A6(VIN1) U23.A7(VIN1) U23.B7(RUN1) U23.K7(RUN2) U23.L5(VIN2) U23.L6(VIN2) U23.L7(VIN2) U24.5(EN) U24.6(MODE) U24.7(AVIN) U24.8(PVIN)
+5V_AN: C59.2 C62.2 C69.2 C77.2 C81.1 C83.2 C84.2 C85.2 C90.2 C107.2 C108.2 L14.1 TP1.TP U12.28(AVCC) U14.3(EN) U14.4(VIN) U15.6(VCC) U15.15(VCC) U15.30(VCC) U15.71(VCC)
+12V: C116.2 C133.A(+) C134.2 C135.2 J7.1 J7.26 J9.C35(12P0V1) J9.C37(12P0V2) R38.2 R39.2 TP12.TP U17.A2(VIN) U17.B3(VIN) U17.D3(VIN) U17.E2(VIN)
+13V_AN: C7.2 C8.2 C9.2 C104.2 C105.2 L15.1 TP2.TP U6.11(V+) U7.11(V+) U8.11(V+) U12.26(AVDD)
+15V: C130.2 L17.2 L18.2 R76.1 U23.A1(VOUT1P) U23.A2(VOUT1P) U23.B1(VOUT1P) U23.B2(VOUT1P)
-13V_AN: C17.2 C18.2 C19.2 C99.2 C103.2 L16.1 TP4.TP U6.2(V-) U6.PAD(V-) U7.2(V-) U7.PAD(V-) U8.2(V-) U8.PAD(V-) U12.6(AVSS) U12.PAD(AVSS)
-15V: C131.1 L19.2 R77.1 U23.G1(VOUT2N) U23.G2(VOUT2N) U23.H1(VOUT2N) U23.H2(VOUT2N) U23.J2(VOUT2N)
ADC_BUSY [50 Ohm Single Mid]: J9.J12(HA11_P) U15.67(BUSY)
ADC_CONVST [50 Ohm Single Mid]: J9.K13(HA10_P) U15.68(CONVST)
ADC_MISO_A [50 Ohm Single Mid]: J9.K11(HA06_N) U15.57(DB12/SDOA)
ADC_MISO_B [50 Ohm Single Mid]: J9.J10(HA07_N) U15.56(DB11/SDOB)
ADC_MOSI [50 Ohm Single Mid]: J9.K10(HA06_P) U15.55(DB10/SDI)
ADC_SCLK [50 Ohm Single Mid]: J9.J13(HA11_N) U15.62(SCLK/!RD)
ADDR0: J9.C27(LA27_N) R78.1 S3.4
ADDR1: J9.C26(LA27_P) R79.1 S3.3
AGND: C7.1 C8.1 C9.1 C17.1 C18.1 C19.1 C59.1 C62.1 C69.1 C77.1 C81.2 C83.1 C84.1 C85.1 C88.1 C90.1 C95.1 C99.1 C100.1 C101.1 C103.1 C104.1 C105.1 C107.1 C108.1 J7.13 J7.14 R48.1 R53.C2 R53.C4 R53.C6 R53.C7 R54.C1 R54.C3 R54.C5 R54.C6 R54.C7 R54.C8 R55.C2 R55.C3 R55.C5 R55.C7 R56.C1 R56.C2 R56.C3 R56.C4 R56.C6 R56.C8 TP3.TP U6.3(GND) U7.3(GND) U8.3(GND) U12.10(AGND) U12.20(NIC) U12.23(N0) U12.24(N1) U12.25(NIC) U12.29(AGND) U12.31(NIC) U14.2(GND) U15.5(AGND) U15.16(AGND) U15.29(AGND) U15.32(REFGND) U15.34(REFINOUTGND) U15.69(REGGND) U15.72(AGND)
AIN_AOUT0: J9.F11(HA08_N) U8.15(IN1)
AIN_AOUT1: J9.D11(LA05_P) U8.6(IN4)
AIN_AOUT2: J9.E12(HA13_P) U8.7(IN3)
AIN_AOUT3: J9.H10(LA04_P) U8.14(IN2)
AIN_AOUT4: J9.E18(HA20_P) U7.15(IN1)
AIN_AOUT5: J9.J9(HA07_P) U7.6(IN4)
AIN_AOUT6: J9.G10(LA03_N) U7.7(IN3)
AIN_AOUT7: J9.F17(HA15_N) U7.14(IN2)
AIN_AOUT8: J9.H20(LA15_N) U6.7(IN3)
AIN_AOUT9: J9.J19(HA18_N) U6.14(IN2)
AIN_AOUT10: J9.G19(LA16_N) U6.6(IN4)
AIN_AOUT11: J9.H19(LA15_P) U6.15(IN1)
AIO_0: J7.7 R53.C1 U8.16(D1)
AIO_1: J7.20 R53.C3 U8.5(D4)
AIO_2: J7.8 R53.C5 U8.8(D3)
AIO_3: J7.21 R53.C8 U8.13(D2)
AIO_4: J7.9 R54.C4 U7.16(D1)
AIO_5: J7.22 R54.C2 U7.5(D4)
AIO_6: J7.10 R56.C5 U7.8(D3)
AIO_7: J7.23 R56.C7 U7.13(D2)
AIO_8: J7.11 R55.C6 U6.8(D3)
AIO_9: J7.24 R55.C8 U6.13(D2)
AIO_10: J7.12 R55.C4 U6.5(D4)
AIO_11: J7.25 R55.C1 U6.16(D1)
AOUT0: U6.1(S1) U12.32(VOUT0)
AOUT1: U6.4(S4) U12.33(VOUT1)
AOUT2: U6.9(S3) U12.34(VOUT2)
AOUT3: U6.12(S2) U12.35(VOUT3)
AOUT4: U7.1(S1) U12.36(VOUT4)
AOUT5: U7.4(S4) U12.37(VOUT5)
AOUT6: U7.12(S2) U12.38(VOUT6)
AOUT7: U7.9(S3) U12.39(VOUT7)
AOUT8: U8.9(S3) U12.12(VOUT8)
AOUT9: U8.12(S2) U12.13(VOUT9)
AOUT10: U8.4(S4) U12.14(VOUT10)
AOUT11: U8.1(S1) U12.15(VOUT11)
CLKIN0: J9.D21(LA17_N_CC) TP7.TP U4.1(OUT)
CLKIN1: J9.E19(HA20_N) TP6.TP U5.1(OUT)
CLKIN_TERM0: J9.K19(HA21_P) R17.1
CLKIN_TERM1: J9.K17(HA17_N_CC) R18.1
CLKIN_VBIAS_SCL: J9.J21(HA22_P) R58.1 U13.7(SCL)
CLKIN_VBIAS_SDA: J9.K20(HA21_N) R57.1 U13.8(SDA)
CLKOUT [50 Ohm Single Mid]: J9.D20(LA17_P_CC) U1.1(IN3) U1.3(IN2)
DAC_MISO [50 Ohm Single Mid]: J9.K16(HA17_P_CC) U12.9(MISO)
DAC_MOSI [50 Ohm Single Mid]: J9.H14(LA07_N) U12.5(MOSI)
DAC_MUX: TP15.TP U12.27(MUX_OUT)
DAC_SCLK [50 Ohm Single Mid]: J9.J15(HA14_P) U12.7(SCLK)
DES_A_D0: J9.F34(HB16_P) U10.24(ROUT0)
DES_A_D1: J9.K35(HB14_N) U10.23(ROUT1)
DES_A_D2: J9.J34(HB15_N) U10.22(ROUT2)
DES_A_D3: J9.K34(HB14_P) U10.21(ROUT3)
DES_A_D4: J9.E33(HB19_P) U10.19(ROUT4)
DES_A_D5: J9.J33(HB15_P) U10.18(ROUT5)
DES_A_D6: J9.F32(HB12_N) U10.16(ROUT6)
DES_A_D7: J9.E31(HB13_N) U10.15(ROUT7)
DES_A_D8: J9.K32(HB10_N) U10.14(ROUT8)
DES_A_D9: J9.F31(HB12_P) U10.13(ROUT9)
DES_A_D10: J9.J31(HB11_N) U10.12(ROUT10)
DES_A_D11: J9.K31(HB10_P) U10.11(ROUT11)
DES_A_GPIO0: J9.J37(HB18_N) U10.28(GPIO0)
DES_A_GPIO1: J9.K37(HB17_P_CC) U10.27(GPIO1)
DES_A_GPIO2: J9.J36(HB18_P) U10.26(GPIO2)
DES_A_GPIO3: J9.E34(HB19_N) R43.1 U10.25(GPIO3/INTB)
DES_A_HSYNC: J9.E30(HB13_P) U10.10(HSYNC)
DES_A_LOCK: J9.E27(HB09_P) R50.2 U10.48(LOCK)
DES_A_PASS: J9.J28(HB07_N) R52.2 U10.47(PASS)
DES_A_PCLK: J9.K28(HB06_P_CC) U10.8(PCLK)
DES_A_PDB: J9.F35(HB16_N) U10.30(PDB)
DES_A_SCL: J9.F29(HB08_N) R31.1 U10.2(SCL)
DES_A_SDA\: J9.E28(HB09_N) R33.1 U10.1(SDA)
DES_A_VSYNC: J9.J30(HB11_P) U10.9(VSYNC)
DES_B_D0: J9.H29(LA24_N) U9.24(ROUT0)
DES_B_D1: J9.H28(LA24_P) U9.23(ROUT1)
DES_B_D2: J9.G28(LA25_N) U9.22(ROUT2)
DES_B_D3: J9.G27(LA25_P) U9.21(ROUT3)
DES_B_D4: J9.D27(LA26_N) U9.19(ROUT4)
DES_B_D5: J9.D26(LA26_P) U9.18(ROUT5)
DES_B_D6: J9.H26(LA21_N) U9.16(ROUT6)
DES_B_D7: J9.G25(LA22_N) U9.15(ROUT7)
DES_B_D8: J9.H25(LA21_P) U9.14(ROUT8)
DES_B_D9: J9.D24(LA23_N) U9.13(ROUT9)
DES_B_D10: J9.G24(LA22_P) U9.12(ROUT10)
DES_B_D11: J9.D23(LA23_P) U9.11(ROUT11)
DES_B_GPIO0: J9.H32(LA28_N) U9.28(GPIO0)
DES_B_GPIO1: J9.G31(LA29_N) U9.27(GPIO1)
DES_B_GPIO2: J9.H31(LA28_P) U9.26(GPIO2)
DES_B_GPIO3: J9.G30(LA29_P) R40.1 U9.25(GPIO3/INTB)
DES_B_HSYNC\: J9.H23(LA19_N) U9.10(HSYNC)
DES_B_LOCK: J9.J22(HA22_N) R49.2 U9.48(LOCK)
DES_B_PASS: J9.K22(HA23_P) R51.2 U9.47(PASS)
DES_B_PCLK: J9.C22(LA18_P_CC) U9.8(PCLK)
DES_B_PDB: J9.G33(LA31_P) U9.30(PDB)
DES_B_SCL: J9.G22(LA20_N) R30.1 U9.2(SCL)
DES_B_SDA: J9.H22(LA19_P) R32.1 U9.1(SDA)
DES_B_VSYNC: J9.K23(HA23_N) U9.9(VSYNC)
DI_VBIAS0: R15.1 U13.3(VOUT0)
DI_VBIAS1: R16.1 U13.4(VOUT1)
DOUTP_F_A [Link]: C45.2 D2.C J2.SIG L2.2 R4.2
DOUTP_F_B [Link]: C44.2 D1.C J1.SIG L1.2 R3.2
FMC_PG: J9.D1(PG_C2M) J9.F1(PG_M2C)
GND: C1.1 C2.1 C3.1 C4.1 C5.1 C6.1 C10.1 C11.1 C12.1 C13.2 C14.2 C15.2 C16.2 C20.1 C21.1 C22.2 C23.2 C24.1 C25.1 C26.1 C27.1 C28.2 C29.2 C30.2 C31.2 C32.2 C33.2 C34.1 C35.1 C36.1 C37.1 C40.1 C41.1 C42.1 C43.1 C46.1 C47.1 C48.1 C49.1 C50.1 C51.1 C52.1 C53.1 C54.1 C55.1 C56.1 C57.1 C58.1 C60.1 C61.1 C63.1 C64.1 C65.1 C66.1 C67.1 C68.1 C70.1 C71.1 C72.1 C73.1 C74.1 C75.1 C76.1 C78.1 C79.1 C80.1 C82.1 C86.1 C87.1 C89.1 C91.1 C92.1 C93.1 C94.1 C96.1 C97.1 C98.1 C102.1 C106.1 C109.1 C110.1 C111.1 C112.1 C113.1 C114.1 C115.2 C116.1 C117.1 C118.1 C119.1 C120.1 C121.1 C122.2 C123.2 C124.2 C125.1 C126.1 C127.1 C128.1 C129.1 C130.1 C131.2 C132.1 C133.C(-) C134.1 C135.1 C136.C(-) C137.1 C138.1 C139.2 C140.2 D1.A D2.A D3.1(A) D4.1(A) D5.1(A) D6.A J1.GND@1 J1.GND@2 J1.GND@3 J1.GND@4 J2.GND@1 J2.GND@2 J2.GND@3 J2.GND@4 J3.GND@1 J3.GND@2 J3.GND@3 J3.GND@4 J4.GND@1 J4.GND@2 J4.GND@3 J4.GND@4 J5.GND@1 J5.GND@2 J5.GND@3 J5.GND@4 J7.PAD1 J7.PAD2 J9.A1(GND) J9.A4(GND) J9.A5(GND) J9.A8(GND) J9.A9(GND) J9.A12(GND) J9.A13(GND) J9.A16(GND) J9.A17(GND) J9.A20(GND) J9.A21(GND) J9.A24(GND) J9.A25(GND) J9.A28(GND) J9.A29(GND) J9.A32(GND) J9.A33(GND) J9.A36(GND) J9.A37(GND) J9.A40(GND) J9.B2(GND) J9.B3(GND) J9.B6(GND) J9.B7(GND) J9.B10(GND) J9.B11(GND) J9.B14(GND) J9.B15(GND) J9.B18(GND) J9.B19(GND) J9.B22(GND) J9.B23(GND) J9.B26(GND) J9.B27(GND) J9.B30(GND) J9.B31(GND) J9.B34(GND) J9.B35(GND) J9.B38(GND) J9.B39(GND) J9.C1(GND) J9.C4(GND) J9.C5(GND) J9.C8(GND) J9.C9(GND) J9.C12(GND) J9.C13(GND) J9.C16(GND) J9.C17(GND) J9.C20(GND) J9.C21(GND) J9.C24(GND) J9.C25(GND) J9.C28(GND) J9.C29(GND) J9.C32(GND) J9.C33(GND) J9.C34(GA0) J9.C36(GND) J9.C38(GND) J9.C40(GND) J9.D2(GND) J9.D6(GND) J9.D7(GND) J9.D10(GND) J9.D13(GND) J9.D16(GND) J9.D19(GND) J9.D22(GND) J9.D25(GND) J9.D28(GND) J9.D35(GA1) J9.D39(GND) J9.E1(GND) J9.E4(GND) J9.E5(GND) J9.E8(GND) J9.E11(GND) J9.E14(GND) J9.E17(GND) J9.E20(GND) J9.E23(GND) J9.E26(GND) J9.E29(GND) J9.E32(GND) J9.E35(GND) J9.E38(GND) J9.E40(GND) J9.F2(GND) J9.F3(GND) J9.F6(GND) J9.F9(GND) J9.F12(GND) J9.F15(GND) J9.F18(GND) J9.F21(GND) J9.F24(GND) J9.F27(GND) J9.F30(GND) J9.F33(GND) J9.F36(GND) J9.F39(GND) J9.G1(GND) J9.G4(GND) J9.G5(GND) J9.G8(GND) J9.G11(GND) J9.G14(GND) J9.G17(GND) J9.G20(GND) J9.G23(GND) J9.G26(GND) J9.G29(GND) J9.G32(GND) J9.G35(GND) J9.G38(GND) J9.G40(GND) J9.H2(PRSNT_M2C_L) J9.H3(GND) J9.H6(GND) J9.H9(GND) J9.H12(GND) J9.H15(GND) J9.H18(GND) J9.H21(GND) J9.H24(GND) J9.H27(GND) J9.H30(GND) J9.H33(GND) J9.H36(GND) J9.H39(GND) J9.J1(GND) J9.J4(GND) J9.J5(GND) J9.J8(GND) J9.J11(GND) J9.J14(GND) J9.J17(GND) J9.J20(GND) J9.J23(GND) J9.J26(GND) J9.J29(GND) J9.J32(GND) J9.J35(GND) J9.J38(GND) J9.J40(GND) J9.K2(GND) J9.K3(GND) J9.K6(GND) J9.K9(GND) J9.K12(GND) J9.K15(GND) J9.K18(GND) J9.K21(GND) J9.K24(GND) J9.K27(GND) J9.K30(GND) J9.K33(GND) J9.K36(GND) J9.K39(GND) J10.2 J10.6 Q1.2(S) Q2.2(S) R1.1 R2.1 R13.1 R14.1 R20.2 R22.2 R28.2 R29.2 R35.2 R37.2 R48.2 R49.1 R50.1 R51.1 R52.1 R62.2 R67.2 R68.2 R71.1 R73.1 R75.1 R80.2 R81.2 S3.1 S3.2 TP8.TP TP9.TP TP10.TP TP17.TP TP18.TP U1.2(GND) U2.4(GND) U2.PAD(GND) U3.8(GND) U3.12(!EN) U4.2(V-) U5.2(V-) U9.43(RES1) U9.44(RES2) U9.46(SEL) U9.PAD(GND) U10.43(RES1) U10.44(RES2) U10.46(SEL) U10.PAD(GND) U11.31(GND) U11.PAD(GND) U12.2(DGND) U13.5(AVSS) U13.6(LAT/HVC) U15.37(SEQEN) U15.38(HW_RNGSEL1) U15.39(HW_RNGSEL0) U15.41(DB0) U15.42(DB1) U15.43(DB2) U15.44(DB3) U15.46(DB5/CRCEN) U15.47(DB6) U15.48(DB7) U15.50(DGND) U15.51(REGGNDD) U15.53(DB8) U15.54(DB9) U15.58(DB13/OS0) U15.59(DB14/OS1) U15.60(DB15/OS2) U15.61(WR!/BURST) U15.64(CHSEL0) U15.65(CHSEL1) U15.66(CHSEL2) U16.3(GND) U16.5(W1) U16.7(VSS) U16.9(W2) U17.B5(GND) U17.C1(GND) U17.C2(GND) U17.C5(SYNC/MODE) U17.D5(GND) U19.3(NC) U19.4(GND) U19.PAD1(PAD) U19.PAD2(PAD) U19.PAD3(PAD) U19.PAD4(PAD) U19.PAD5(PAD) U20.3(NC) U20.4(GND) U20.PAD1(PAD) U20.PAD2(PAD) U20.PAD3(PAD) U20.PAD4(PAD) U20.PAD5(PAD) U21.3(NC) U21.4(GND) U21.PAD1(PAD) U21.PAD2(PAD) U21.PAD3(PAD) U21.PAD4(PAD) U21.PAD5(PAD) U22.1(A0) U22.2(A1) U22.3(A2) U22.4(GND) U22.7(WP) U23.A3(GND) U23.A4(GND) U23.B3(GND) U23.B4(GND) U23.B5(GND) U23.B6(GND) U23.C2(VOUT1N) U23.C3(GND) U23.C4(GND) U23.C5(GND) U23.C6(GND) U23.D1(VOUT1N) U23.D2(VOUT1N) U23.D3(GND) U23.D4(GND) U23.D5(GND) U23.D7(SYNC1) U23.E1(VOUT1N) U23.E2(VOUT1N) U23.E3(GND) U23.E4(GND) U23.E5(GND) U23.F1(GND) U23.F2(GND) U23.F5(GND) U23.F6(GND) U23.F7(GND) U23.G3(GND) U23.G4(GND) U23.G5(GND) U23.H3(GND) U23.H4(GND) U23.H5(GND) U23.J3(GND) U23.J4(GND) U23.J5(GND) U23.J6(GND) U23.K1(VOUT2P) U23.K2(VOUT2P) U23.K3(GND) U23.K4(GND) U23.K5(GND) U23.K6(GND) U23.L1(VOUT2P) U23.L2(VOUT2P) U23.L3(GND) U23.L4(GND) U24.1(PGND) U24.3(AGND) U24.PAD(AGND)
LINK_A_PWR_EN: J9.H37(LA32_P) R68.1 U17.B2(RUN2)
LINK_B_PWR_EN: J9.K38(HB17_N_CC) R67.1 U17.D2(RUN1)
LINK_PWR_ADJ_MISO: J9.F37(HB20_P) R69.2 U16.15(MISO)
LINK_PWR_ADJ_MOSI: J9.E36(HB21_P) U16.14(MOSI)
LINK_PWR_ADJ_SCLK: J9.H38(LA32_N) U16.13(SCLK)
LVDS_DIN0 [100 Ohm Diff Mid]: J9.J2(CLK3_M2C_P) U3.3(AOUT)
LVDS_DIN0_N [100 Ohm Diff Mid]: J7.4 R25.1 U3.1(A-)
LVDS_DIN0_P [100 Ohm Diff Mid]: J7.17 R25.2 U3.2(A+)
LVDS_DIN1 [100 Ohm Diff Mid]: J9.H5(CLK0_M2C_N) U3.5(BOUT)
LVDS_DIN1_N [100 Ohm Diff Mid]: J7.16 R26.1 U3.7(B-)
LVDS_DIN1_P [100 Ohm Diff Mid]: J7.3 R26.2 U3.6(B+)
LVDS_DIN2 [100 Ohm Diff Mid]: J9.H4(CLK0_M2C_P) U3.11(COUT)
LVDS_DIN2_N [100 Ohm Diff Mid]: J7.2 R27.1 U3.9(C-)
LVDS_DIN2_P [100 Ohm Diff Mid]: J7.15 R27.2 U3.10(C+)
LVDS_DOUT0 [100 Ohm Diff Mid]: J9.J3(CLK3_M2C_N) U2.2(AIN)
LVDS_DOUT0_N [100 Ohm Diff Mid]: J7.19 U2.7(AOUT-)
LVDS_DOUT0_P [100 Ohm Diff Mid]: J7.6 U2.8(AOUT+)
LVDS_DOUT1 [100 Ohm Diff Mid]: J9.K4(CLK2_M2C_P) U2.3(BIN)
LVDS_DOUT1_N [100 Ohm Diff Mid]: J7.18 U2.5(BOUT-)
LVDS_DOUT1_P [100 Ohm Diff Mid]: J7.5 U2.6(BOUT+)
MLVDS_CLK_0_N [130 Ohm Diff Top]: J6.10 U11.24(B0)
MLVDS_CLK_0_P [130 Ohm Diff Top]: J6.09 U11.23(A0)
MLVDS_CLK_1_N [130 Ohm Diff Top]: J6.08 U11.22(B1)
MLVDS_CLK_1_P [130 Ohm Diff Top]: J6.07 U11.21(A1)
MLVDS_CLK_2_N [130 Ohm Diff Top]: J6.04 U11.20(B2)
MLVDS_CLK_2_P [130 Ohm Diff Top]: J6.03 U11.19(A2)
MLVDS_CLK_3_N [130 Ohm Diff Top]: J6.02 U11.18(B3)
MLVDS_CLK_3_P [130 Ohm Diff Top]: J6.01 U11.17(A3)
MLVDS_DE_!RE0: J9.F7(HA04_P) U11.25(DE0) U11.26(!RE0)
MLVDS_DE_!RE1: J9.E7(HA05_N) U11.27(DE1) U11.28(!RE1)
MLVDS_DE_!RE2: J9.H7(LA02_P) U11.13(!RE2) U11.14(DE2)
MLVDS_DE_!RE3: J9.H8(LA02_N) U11.15(!RE3) U11.16(DE3)
MLVDS_DI0: J9.F5(HA00_N_CC) U11.2(DI0)
MLVDS_DI1: J9.E2(HA01_P_CC) U11.4(DI1)
MLVDS_DI2: J9.E3(HA01_N_CC) U11.6(DI2)
MLVDS_DI3: J9.G3(CLK1_M2C_N) U11.8(DI3)
MLVDS_EN: J9.F8(HA04_N) U11.10(MDE)
MLVDS_RO0: J9.F4(HA00_P_CC) U11.1(RO0)
MLVDS_RO1: J9.G6(LA00_P_CC) U11.3(RO1)
MLVDS_RO2: J9.G7(LA00_N_CC) U11.5(RO2)
MLVDS_RO3: J9.G2(CLK1_M2C_P) U11.7(RO3)
N$1: L13.2 U24.2(SW)
N$2: Q1.3(D) R5.1 R7.1 R11.1
N$3: R23.2 U4.3(+IN)
N$4: L1.1 L5.2 R3.1 R9.2
N$5: R61.1 U17.A4(FB2)
N$6 [50 Ohm Single Top]: F2.1 J4.SIG
N$7: Q2.3(D) R6.1 R8.1 R12.1
N$8: C110.2 U17.A3(TRACK/SS2)
N$9: R81.1 U23.G7(RT2)
N$10: R60.1 U17.E4(FB1)
N$11 [50 Ohm Single Top]: F1.1 J3.SIG
N$12: C112.2 U17.E3(TRACK/SS1)
N$14 [50 Ohm Single Top]: F3.1 J5.SIG
N$15: C125.2 L17.1 U19.5(EN) U19.8(IN)
N$17: R80.1 U23.E7(RT1)
N$18: C13.1 R15.2 U4.4(-IN)
N$19: R24.2 U5.3(+IN)
N$20: C14.1 R16.2 U5.4(-IN)
N$21: L2.1 L6.2 R4.1 R10.2
N$22: C6.2 C16.1 L6.1 L8.2 R10.1
N$23: R55.1 U15.79(V3B)
N$24: C5.2 C15.1 L5.1 L7.2 R9.1
N$25: R77.2 U23.J1(FBX2)
N$27: C45.1 U10.41(RIN0+)
N$28: C39.1 U10.42(RIN0-)
N$29: R76.2 U23.C1(FBX1)
N$30: C36.2 C42.2 C47.2 U10.3(VDD11_D)
N$31: C37.2 C43.2 U10.20(VDD11_DVP)
N$32: C39.2 R29.1
N$33: C122.1 U19.6(NR/SS)
N$34: Q2.1(G) R14.2 R18.2
N$35: U23.E6(CLKOUT1) U23.H7(SYNC2)
N$37: Q1.1(G) R13.2 R17.2
N$38: C44.1 U9.41(RIN0+)
N$39: R55.2 U15.80(V3BGND)
N$40: R70.1 R71.2 U19.2(FB)
N$42: C126.2 L18.1 U20.5(EN) U20.8(IN)
N$43: C123.1 U20.6(NR/SS)
N$45: C68.2 C76.2 C80.2 U10.34(VDD11_FPD)
N$46: C115.1 R66.1 U15.36(!RESET)
N$47: C55.2 C60.2 C64.2 C71.2 L11.2 U9.7(VDDIO) U9.29(VDDIO)
N$48: C34.2 C40.2 C46.2 U9.3(VDD11_D)
N$49: C35.2 C41.2 U9.20(VDD11_DVP)
N$50: C67.2 C75.2 C79.2 U9.34(VDD11_FPD)
N$51: C129.2 J9.CHASSIS_B(STANDOFF_B)
N$52: C128.2 J9.CHASSIS_A(STANDOFF_A)
N$54: J10.5 R42.2
N$55: C38.1 U9.42(RIN0-)
N$56: R72.1 R73.2 U20.2(FB)
N$57: J10.7 R47.1
N$58: C127.2 L19.1 U21.5(EN) U21.8(IN)
N$59: C124.1 U21.6(NR/SS)
N$60: R74.1 R75.2 U21.2(FB)
N$61: R65.2 U15.45(DB4/!SER1WR)
N$62: R53.1 U15.28(V0A)
N$63: R64.2 U15.40(SER/!PAR)
N$64: C95.2 U15.31(REFCAP)
N$65: R53.2 U15.27(V0AGND)
N$66: J10.8 R41.1
N$67: C109.2 U15.52(REGCAPD)
N$68: R55.8 U15.73(V0B)
N$69: C101.2 U15.70(REGCAP)
N$71: R63.2 U15.35(REFSEL)
N$72: R56.7 U15.2(V4B)
N$73: R56.1 U15.10(V7BGND)
N$74: R55.7 U15.74(V0BGND)
N$75: R55.6 U15.75(V1B)
N$76: R55.5 U15.76(V1BGND)
N$77: R55.4 U15.77(V2B)
N$78: R55.3 U15.78(V2BGND)
N$79: R53.3 U15.26(V1A)
N$80: R53.4 U15.25(V1AGND)
N$81: R53.5 U15.24(V2A)
N$82: R53.6 U15.23(V2AGND)
N$83: R53.8 U15.22(V3A)
N$84: R53.7 U15.21(V3AGND)
N$85: R54.2 U15.19(V4A)
N$86: R54.1 U15.20(V4AGND)
N$87: R54.4 U15.17(V5A)
N$88: R54.3 U15.18(V5AGND)
N$89: R54.5 U15.14(V6A)
N$90: R54.6 U15.13(V6AGND)
N$91: R54.7 U15.12(V7A)
N$92: R54.8 U15.11(V7AGND)
N$93: C38.2 R28.1
N$94: R56.8 U15.1(V4BGND)
N$95: R56.5 U15.4(V5B)
N$96: R56.6 U15.3(V5BGND)
N$97: R56.4 U15.7(V6B)
N$98: R56.3 U15.8(V6BGND)
N$99: R56.2 U15.9(V7B)
N$100: R34.2 R35.1 U9.35(IDX)
N$101: J10.4 R45.1
N$102: J10.3 R46.1
N$103: J10.1 R44.1
N$122: R60.2 U16.4(A1)
N$123: R61.2 U16.8(A2)
N$145: R62.1 U17.C4(FREQ)
N$200: C56.2 C61.2 C66.2 C73.2 L12.2 U10.7(VDDIO) U10.29(VDDIO)
N$402: S2.1 U10.6(BISTEN)
N$403: R21.2 R22.1 U10.37(MODE)
N$404: R36.2 R37.1 U10.35(IDX)
N$500: C119.2 L14.2 R70.2 U19.1(OUT)
N$501: C120.2 L15.2 R72.2 U20.1(OUT)
N$502: C121.2 L16.2 R74.2 U21.1(OUT)
N$506: C100.2 R59.1 U15.33(REFINOUT)
N$603: S1.1 U9.6(BISTEN)
N$604: R19.2 R20.1 U9.37(MODE)
PORT_A_BLUE: J9.G18(LA16_P) R41.2
PORT_A_GREEN: J9.J18(HA18_P) R47.2
PORT_A_RED: J9.H17(LA11_N) R42.1
PORT_B_BLUE: J9.H16(LA11_P) R45.2
PORT_B_GREEN: J9.G15(LA12_P) R46.2
PORT_B_RED: J9.G13(LA08_N) R44.2
SCL: J9.C30(SCL) U22.6(SCL)
SDA: J9.C31(SDA) U22.5(SDA)
TDI-TDO: J9.D30(TDI) J9.D31(TDO)
V_PROTECT: C52.2 D3.2(C) D4.2(C) D5.2(C) D6.C R38.1 R39.1 TP5.TP
VAUX: C132.2 J9.D32(3P3VAUX) U22.8(VCC)
VDD_FPDX_A: C2.2 C4.2 C12.2 C21.2 C25.2 L4.1 U10.31(VDD18_FPD1) U10.40(VDD18_FPD0)
VDD_FPDX_B: C1.2 C3.2 C11.2 C20.2 C24.2 L3.1 U9.31(VDD18_FPD1) U9.40(VDD18_FPD0)
VDD_PX_A: C49.2 C51.2 C54.2 C58.2 C65.2 C72.2 L10.2 U10.36(VDD18_P1) U10.45(VDD18_P0)
VDD_PX_B: C48.2 C50.2 C53.2 C57.2 C63.2 C70.2 L9.2 U9.36(VDD18_P1) U9.45(VDD18_P0)
VLINK_A: C27.2 C31.1 C94.2 C97.2 L8.1 TP13.TP U17.A1(VOUT2) U17.B1(VOUT2)
VLINK_B: C26.2 C30.1 C98.2 C102.2 L7.1 TP14.TP U17.D1(VOUT1) U17.E1(VOUT1)
VREF: C88.2 R59.2 U12.22(VREF) U14.5(VOUT)
Unconnected: J6.05 J6.06 J8.BEZ1 J8.BEZ2 J9.A2(DP1_M2C_P) J9.A3(DP1_M2C_N) J9.A6(DP2_M2C_P) J9.A7(DP2_M2C_N) J9.A10(DP3_M2C_P) J9.A11(DP3_M2C_N) J9.A14(DP4_M2C_P) J9.A15(DP4_M2C_N) J9.A18(DP5_M2C_P) J9.A19(DP5_M2C_N) J9.A22(DP1_C2M_P) J9.A23(DP1_C2M_N) J9.A26(DP2_C2M_P) J9.A27(DP2_C2M_N) J9.A30(DP3_C2M_P) J9.A31(DP3_C2M_N) J9.A34(DP4_C2M_P) J9.A35(DP4_C2M_N) J9.A38(DP5_C2M_P) J9.A39(DP5_C2M_N) J9.B1(RES1) J9.B4(DP9_M2C_P) J9.B5(DP9_M2C_N) J9.B8(DP8_M2C_P) J9.B9(DP8_M2C_N) J9.B12(DP7_M2C_P) J9.B13(DP7_M2C_N) J9.B16(DP6_M2C_P) J9.B17(DP6_M2C_N) J9.B20(GBTCLK1_M2C_P) J9.B21(GBTCLK1_M2C_N) J9.B24(DP9_C2M_P) J9.B25(DP9_C2M_N) J9.B28(DP8_C2M_P) J9.B29(DP8_C2M_N) J9.B32(DP7_C2M_P) J9.B33(DP7_C2M_N) J9.B36(DP6_C2M_P) J9.B37(DP6_C2M_N) J9.B40(RES0) J9.C2(DP0_C2M_P) J9.C3(DP0_C2M_N) J9.C6(DP0_M2C_P) J9.C7(DP0_M2C_N) J9.C10(LA06_P) J9.C11(LA06_N) J9.C14(LA10_P) J9.C15(LA10_N) J9.C18(LA14_P) J9.C19(LA14_N) J9.C23(LA18_N_CC) J9.C39(3P3V1) J9.D4(GBTCLK0_M2C_P) J9.D5(GBTCLK0_M2C_N) J9.D8(LA01_P_CC) J9.D9(LA01_N_CC) J9.D12(LA05_N) J9.D14(LA09_P) J9.D15(LA09_N) J9.D17(LA13_P) J9.D18(LA13_N) J9.D29(TCK) J9.D33(TMS) J9.D34(TRST_L) J9.D36(3P3V2) J9.D38(3P3V3) J9.D40(3P3V4) J9.E6(HA05_P) J9.E9(HA09_P) J9.E10(HA09_N) J9.E13(HA13_N) J9.E15(HA16_P) J9.E16(HA16_N) J9.E21(HB03_P) J9.E22(HB03_N) J9.E24(HB05_P) J9.E25(HB05_N) J9.F13(HA12_P) J9.F16(HA15_P) J9.F19(HA19_P) J9.F20(HA19_N) J9.F22(HB02_P) J9.F23(HB02_N) J9.F25(HB04_P) J9.F26(HB04_N) J9.F28(HB08_P) J9.G9(LA03_P) J9.G12(LA08_P) J9.G16(LA12_N) J9.G21(LA20_P) J9.G34(LA31_N) J9.G36(LA33_P) J9.G37(LA33_N) J9.H1(VREF_A_M2C) J9.H11(LA04_N) J9.H34(LA30_P) J9.H35(LA30_N) J9.J6(HA03_P) J9.J7(HA03_N) J9.J24(HB01_P) J9.J25(HB01_N) J9.J27(HB07_P) J9.K1(VREF_B_M2C) J9.K5(CLK2_M2C_N) J9.K7(HA02_P) J9.K8(HA02_N) J9.K14(HA10_N) J9.K25(HB00_P_CC) J9.K26(HB00_N_CC) J9.K29(HB06_N_CC) U3.13(DOUT) U3.14(D+) U3.15(D-) U9.32(RIN1+) U9.33(RIN1-) U9.38(CMLOUTP) U9.39(CMLOUTN) U10.32(RIN1+) U10.33(RIN1-) U10.38(CMLOUTP) U10.39(CMLOUTN) U11.9(FSEN2) U11.32(FSEN1) U12.1(DNC) U12.11(DNC) U12.16(VOUT12) U12.17(VOUT13) U12.18(VOUT14) U12.19(VOUT15) U12.21(DNC) U12.30(DNC) U12.40(DNC) U16.6(B1) U16.10(B2) U17.A5(COMP2) U17.B4(PGOOD2) U17.C3(INTVCC) U17.D4(PGOOD1) U17.E5(COMP1) U19.7(DNC) U20.7(DNC) U21.7(DNC) U23.C7(SS1) U23.D6(PG1) U23.F3(SHARE1) U23.F4(SHARE2) U23.G6(CLKOUT2) U23.H6(PG2) U23.J7(SS2)

## Notes on the sheet
- ANALOG IO
- NB: Worst case 100 mA draw from
  both ADC and DAC. With 10V stepdown, 
  this is 1W dissipation.
- ANALOG POWER
- FMC IO
- PIN COUNTS
  - Total IO pins: 114
  
  - LVDS pairs: 5 (TPs)
  - SE pins: 104 (Others)
  
  - LVDS CC pairs: 1 (TP0)
  - SE CC pins: 9 (PCLKs, 
  DIs, DOs, MVLDSs)
- PIN       ADC    DAC
  --------------------------
  AIO_11   3B     0
  AIO_10   2B     1
  AIO_9     0B     3
  AIO_8     1B     2
  AIO_7     4B     6
  AIO_6     5B     7
  AIO_5     4A     5
  AIO_4     5A     4
  AIO_3     3A     9
  AIO_2     2A     8
  AIO_1     1A     10
  AIO_0     0A     11
- HPC FMC
- DNP
- NB: For best performance,
  quads should only be input
  or output, not mixtures.
- DNP
- DNP
- DNP
- DNP
- DNP
- DNP
- Quad 1
- DNP
- DNP
- NB: Use both 
  MISO lines
- Quad 2
- DNP
- DNP
- Quad 3
- DNP
- DNP
- TP1
- NB: P,N order 
  matches SDR
  datasheet spec.
- TP2 | DNP
- DNP
- TP3
- TP4 | DNP
- DNP
- TP5
- DNP
- DNP
- NB: R-arrays provide input
  protection. Limit current 
  thru internal clamp 
  diodes to 10 mA at 20V.
- NB: DC signals
  so no worries 
  about DGND
- DNP
- NB: TO MRCC Pin | DNP
- DNP
- NB: TO MRCC Pin
- CLOCK IO
- CLK IN 0
- NB: DI0 and DO0
  go to CC pins
- NB: Pulled up
  to 3.3V on carrier
- NB: Default 
  VBIAS = 1.65V
- NB: Input
  protection
  voltage ~4.6V
- NB: GA0 and GA1 
  define the LSBs of 
  the EEPROM I2C address.
  We use 0x1010000
- CLK IN 1
- NB: All IO to to CC
  Pin or better
- SYNC. TRIG.
- LINK POWER
- CLK OUT
- NB: VADJ must be set
  to 1.8V on host board!
- NB: Freq =
  1.48 MHz
- NB: 3.48k =
  11V output.
- SYNC
- NB: VLINK adjust.
  - Max step down ratio: 1 - (45e-9 *1.48e6) = 0.933
  - So max voltage = 11.19
  - Linear mode selected
  - R_AW = 0 : VLINK = 11.0V
  - R_AW = 5k : VLINK = 5.0V
  - General:
    VLINK = 36.24k/(3.48k + R_AW) + 0.6
- PANEL RGB
- LINK B
- NB: PCLK goes 
  to dedicated
  MRCC pin
- DNP
- Power: ~1.3A DC at 12V; 15.6W. With
  90% efficiency regulation to 5.5V at
  serializer, this translates to 2.55A
  available, which is enough for 1A/LED 
  + 500 mA serializer and FPGA.
- L2 is the smallest package size I could
  find that barely meets current saturation
  requriements. An 8x8mm device that is
  probably safer is the Bourns SRN8040TA
  series.
- LINK B
- DES. CORE POWER
- LINK A
- NB: Required 
  by FMC standard.
  Other option is to 
  directly connect to
  front bezel
- NB: PCLK goes
  to dedicated
  MRCC pin
- NB: FMC FRU 
  module. Required 
  by FMC standard.
- DNP | DNP
- FMC MEZZANINE
- DNP
- NB: Board address
- Power: ~1.3A DC at 12V; 15.6W. With
  90% efficiency regulation to 5.5V at
  serializer, this translates to 2.55A
  available, which is enough for 1A/LED 
  + 500 mA serializer and FPGA.
- L2 is the smallest package size I could
  find that barely meets current saturation
  requriements. An 8x8mm device that is
  probably safer is the Bourns SRN8040TA
  series.
- LINK A
- NB: Standoff connectors
  on front bezel and on 
  FMC connector should
  be isolated from GND
  and tied to chassis ground
  to form a star connection.
- FMC IO

## Power pins joined to a net without a drawn wire
GND: J9.D3(GND) J9.D37(GND)

## Library data of the parts
C1-C39 C41 C43-C58 C60 C61 C63 C65 C67 C68 C70-C73 C78-C87 C89-C94 C97-C100 C102 C104 C106 C107 C110-C112 C114 C115 C118 C122-C124 C128-C132 C134 C135 C137-C140 = jonnew:C: Capacitor
C40 C42 C59 C62 C64 C66 C69 C74-C77 C88 C95 C96 C101 C103 C105 C108 C109 C113 C116 C117 C119-C121 C125-C127 = jonnew:C: Capacitor; MN: TDK Corp.; PARTNO: C2012X5R1Cxxxxxxx; VID: DK
C133 C136 = jonnew:C-POL: Polarized Capacitor
D1 D2 D6 = jonnew:Z-DIODE: Zener Diode
D3-D5 = jonnew:DIODE2
F1-F3 = jonnew:FUSE
J1-J5 = jonnew:COAX: COAX CONNECTOR - Edge mount BNC - Vertical BNC - Vertical SMA - etc
J6 = jonnew:PINHD-2X5
J7 = jonnew:PINHD-1X26
J8 = jonnew:FMC_SINGLE_WIDTH_MODULE
J9 = jonnew:FMC_HPC_400_PIN
J10 = jonnew:PINHD-1X8
L1-L13 = jonnew:L: Inductor
L14-L19 = jonnew:L: Inductor; PARTNO: BLM15PX601SN1D
Q1 Q2 = jonnew:N-MOSFET: N-CHANNEL MOS FET SYMBOL
R1-R4 R9 R10 R13-R52 R57-R81 = jonnew:R: Resistor
R5-R8 R11 R12 = jonnew:R: Resistor; DK: PxxxxHTR-ND; MN: Panasonic; MPN: ERJ-3EKFxxxxV
R53-R56 = jonnew:RN2X8
S1 S2 = jonnew:DIPSW-001
S3 = jonnew:DIPSW-002: Dip Switch 2 pol.
TP1-TP18 = jonnew:TP: Test pad
U1 = jonnew:BUFFER-DUAL
U2 = jonnew:LVDS_DRIVER_DUAL
U3 = jonnew:LVDS_RECEIVER_QUAD
U4 U5 = jonnew:COMPARITOR
U6-U8 = jonnew:DG141XE_QUAD_SPST
U9 U10 = jonnew:DS90UB934-Q1
U11 = jonnew:DS91M040
U12 = jonnew:AD5767BCBZ-RL7
U13 = jonnew:MCP47FEBX2
U14 = jonnew:VREF_EN
U15 = jonnew:AD7617BSTZ; MANUFACTURER_PART_NUMBER: AD7617BSTZ; VENDOR: Analog Devices Inc
U16 = jonnew:AD51X2
U17 = jonnew:LTM4622
U19-U21 = jonnew:TPS7AXX: ?36V, ?200mA, Ultralow-Noise, Negative LINEAR REGULATOR
U22 = jonnew:24*: Serial EEPROM I2C; MPN: 25AA640A-I/ST; OC_FARNELL: 1818513; OC_NEWARK: 27M1300
U23 = jonnew:LTM8049
U24 = jonnew:TPS6206X
X2 = jonnew:OE-LOGO

## Net classes
1 130 Ohm Diff Top: width 0.09 mm, drill 0.2 mm, clearance 0.089 mm
2 50 Ohm Single Top: width 0.15 mm, drill 0.2 mm
3 100 Ohm Diff Mid: width 0.19 mm, drill 0.2 mm, clearance 0.09 mm
4 50 Ohm Single Mid: width 0.2 mm, drill 0.2 mm
5 100 Ohm Diff Top: width 0.15 mm, drill 0.2 mm, clearance 0.09 mm
6 Link: width 0.15 mm, drill 0.2 mm, clearance 0.5 mm
7 CAN 210 Diff Top: width 0.11 mm, drill 0.2 mm, clearance 0.09 mm